# EAGLE design sound (EAGLE 9.4.2)

## Sheet 1 of 4: Bus interface
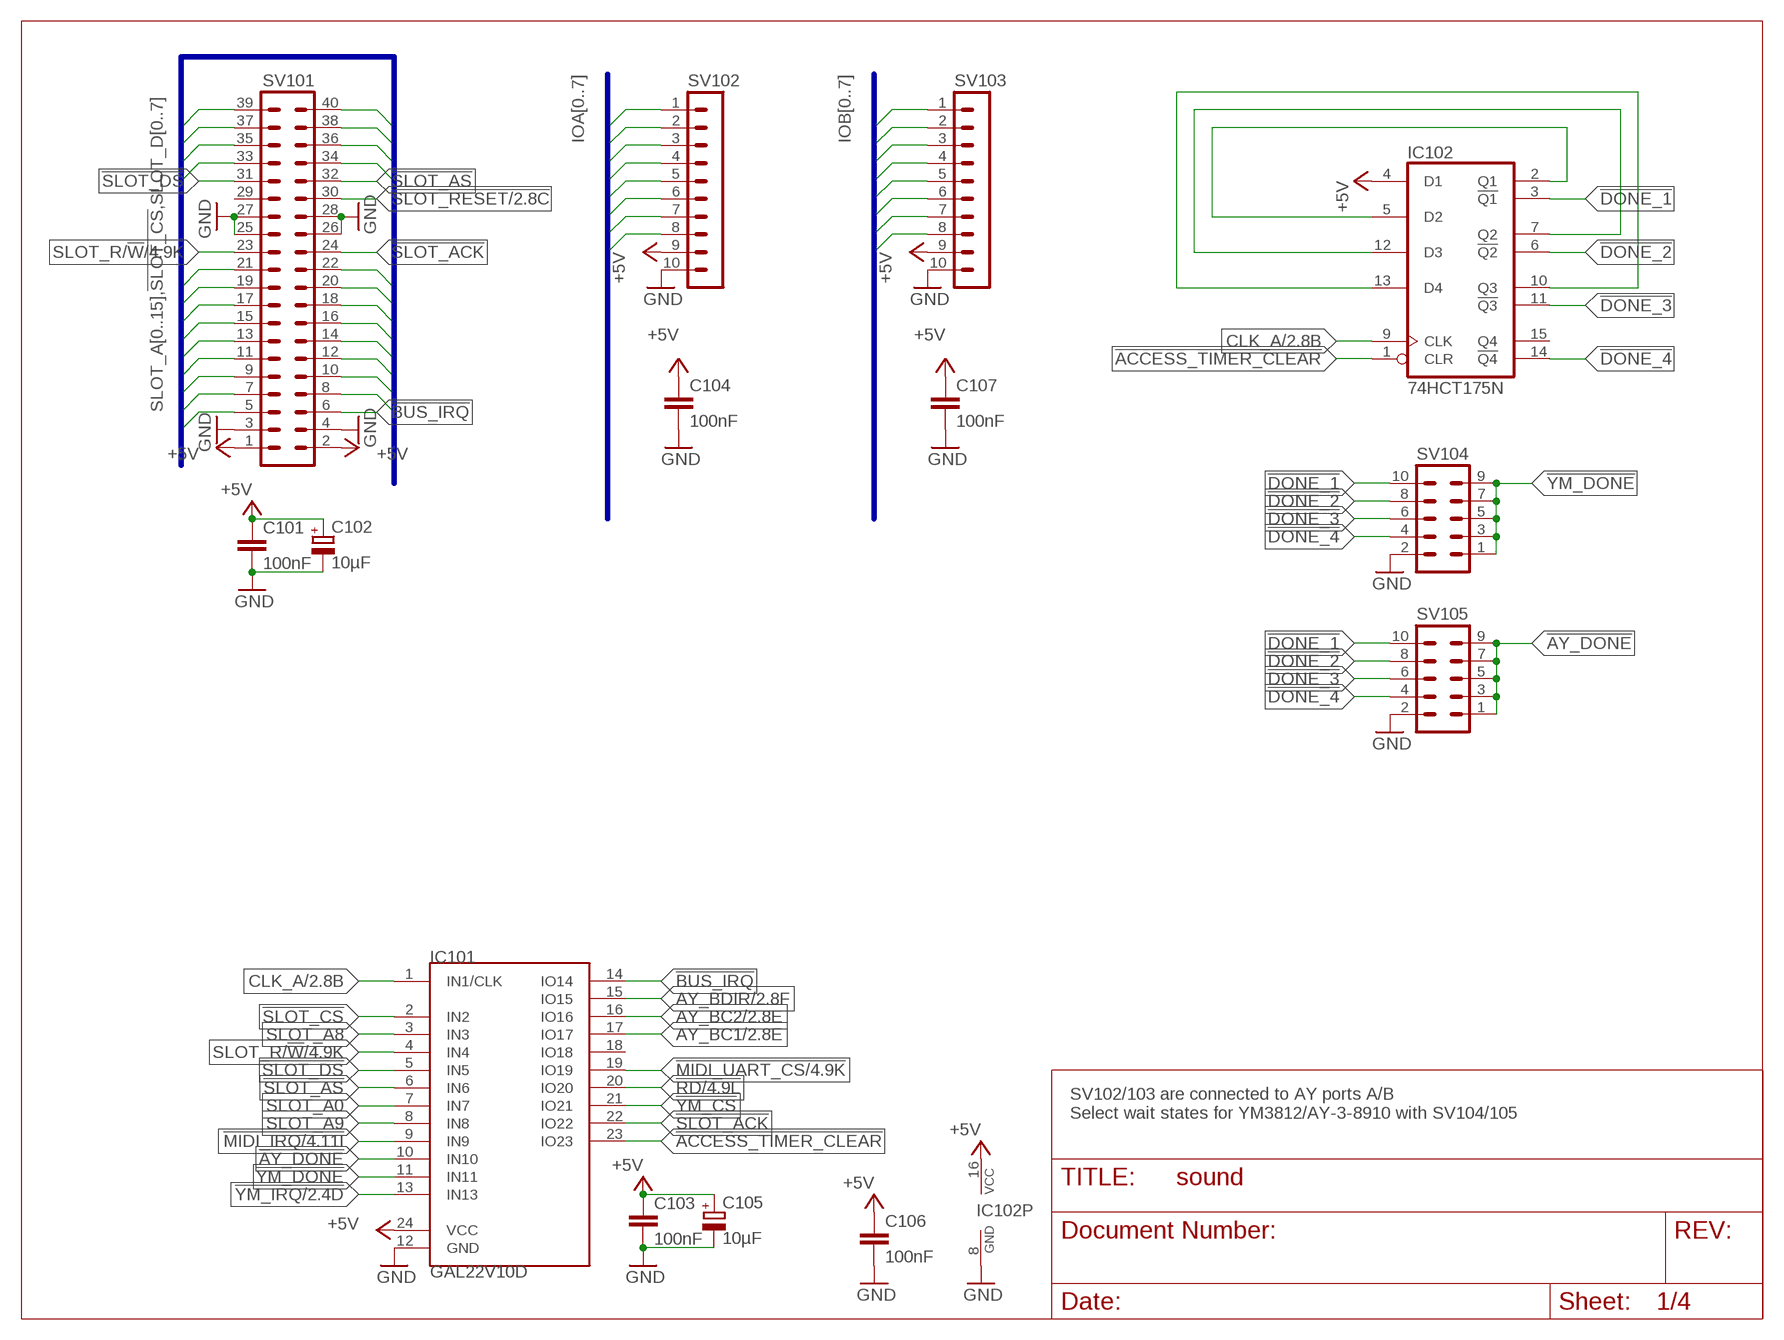
[diagram p0: schematic, sheet 1]

### Parts
C101  100nF  C-EUC0805  [C0805]
C102  10µF  CPOL-EUSMCB  [SMC_B]
C103  100nF  C-EUC0805  [C0805]
C104  100nF  C-EUC0805  [C0805]
C105  10µF  CPOL-EUSMCB  [SMC_B]
C106  100nF  C-EUC0805  [C0805]
C107  100nF  C-EUC0805  [C0805]
IC101  GAL22V10D  GAL22V10DIP24  [DIL24S]
IC102  74HCT175N  [DIL16]
SV101  MA20-2W  [MA20-2W]
SV102  MA10-1  [MA10-1]
SV103  MA10-1  [MA10-1]
SV104  MA05-2  [MA05-2]
SV105  MA05-2  [MA05-2]

### Nets
!ACCESS_TIMER_CLEAR: IC101.23(IO23) IC102.1(CLR)
!AY_DONE: IC101.10(IN10) SV105.1 SV105.3 SV105.5 SV105.7 SV105.9
!BUS_IRQ: IC101.14(IO14) SV101.6
!DONE_1: IC102.3(!Q1) SV104.10 SV105.10
!DONE_2: IC102.6(!Q2) SV104.8 SV105.8
!DONE_3: IC102.11(!Q3) SV104.6 SV105.6
!DONE_4: IC102.14(!Q4) SV104.4 SV105.4
!MIDI_IRQ: IC101.9(IN9) ; also sheet 4
!MIDI_UART_CS: IC101.19(IO19) ; also sheet 4
!RD: IC101.20(IO20) ; also sheet 2,4
!SLOT_ACK: IC101.22(IO22) SV101.24
!SLOT_AS: IC101.6(IN6) SV101.32
!SLOT_CS: IC101.2(IN2) SV101.5
!SLOT_DS: IC101.5(IN5) SV101.31
!SLOT_RESET: SV101.30 ; also sheet 2,4
!YM_CS: IC101.21(IO21) ; also sheet 2
!YM_DONE: IC101.11(IN11) SV104.1 SV104.3 SV104.5 SV104.7 SV104.9
!YM_IRQ: IC101.13(IN13) ; also sheet 2
+5V: C101.1 C102.+ C103.1 C104.1 C105.+ C106.1 C107.1 IC101.24(VCC) IC102.4(D1) IC102.16(VCC) SV101.1 SV101.2 SV102.9 SV103.9 ; also sheet 2,3,4
AY_BC1: IC101.17(IO17) ; also sheet 2
AY_BC2: IC101.16(IO16) ; also sheet 2
AY_BDIR: IC101.15(IO15) ; also sheet 2
CLK_A: IC101.1(IN1/CLK) IC102.9(CLK) ; also sheet 2
GND: C101.2 C102.- C103.2 C104.2 C105.- C106.2 C107.2 IC101.12(GND) IC102.8(GND) SV101.3 SV101.4 SV101.25 SV101.26 SV101.27 SV101.28 SV102.10 SV103.10 SV104.2 SV105.2 ; also sheet 2,3,4
IOA0: SV102.1 ; also sheet 2
IOA1: SV102.2 ; also sheet 2
IOA2: SV102.3 ; also sheet 2
IOA3: SV102.4 ; also sheet 2
IOA4: SV102.5 ; also sheet 2
IOA5: SV102.6 ; also sheet 2
IOA6: SV102.7 ; also sheet 2
IOA7: SV102.8 ; also sheet 2
IOB0: SV103.1 ; also sheet 2
IOB1: SV103.2 ; also sheet 2
IOB2: SV103.3 ; also sheet 2
IOB3: SV103.4 ; also sheet 2
IOB4: SV103.5 ; also sheet 2
IOB5: SV103.6 ; also sheet 2
IOB6: SV103.7 ; also sheet 2
IOB7: SV103.8 ; also sheet 2
N$2: IC102.10(Q3) IC102.13(D4)
N$5: IC102.2(Q1) IC102.5(D2)
N$6: IC102.7(Q2) IC102.12(D3)
SLOT_A0: IC101.7(IN7) SV101.12 ; also sheet 2,4
SLOT_A1: SV101.10 ; also sheet 4
SLOT_A2: SV101.8 ; also sheet 4
SLOT_A3: SV101.7
SLOT_A4: SV101.9
SLOT_A5: SV101.11
SLOT_A6: SV101.14
SLOT_A7: SV101.13
SLOT_A8: IC101.3(IN3) SV101.16
SLOT_A9: IC101.8(IN8) SV101.15
SLOT_A10: SV101.18
SLOT_A11: SV101.17
SLOT_A12: SV101.20
SLOT_A13: SV101.19
SLOT_A14: SV101.22
SLOT_A15: SV101.21
SLOT_D0: SV101.35 ; also sheet 2,4
SLOT_D1: SV101.37 ; also sheet 2,4
SLOT_D2: SV101.39 ; also sheet 2,4
SLOT_D3: SV101.40 ; also sheet 2,4
SLOT_D4: SV101.38 ; also sheet 2,4
SLOT_D5: SV101.36 ; also sheet 2,4
SLOT_D6: SV101.34 ; also sheet 2,4
SLOT_D7: SV101.33 ; also sheet 2,4
SLOT_R/!W!: IC101.4(IN4) SV101.23 ; also sheet 2,4
Unconnected: IC101.18(IO18) IC102.15(Q4) SV101.29

### Buses
SLOT_A[0..15],!SLOT_CS,SLOT_D[0..7]
IOA[0..7]
IOB[0..7]

### Notes on the sheet
- SV102/103 are connected to AY ports A/B
  Select wait states for YM3812/AY-3-8910 with SV104/105

## Sheet 2 of 4: Sound Generators
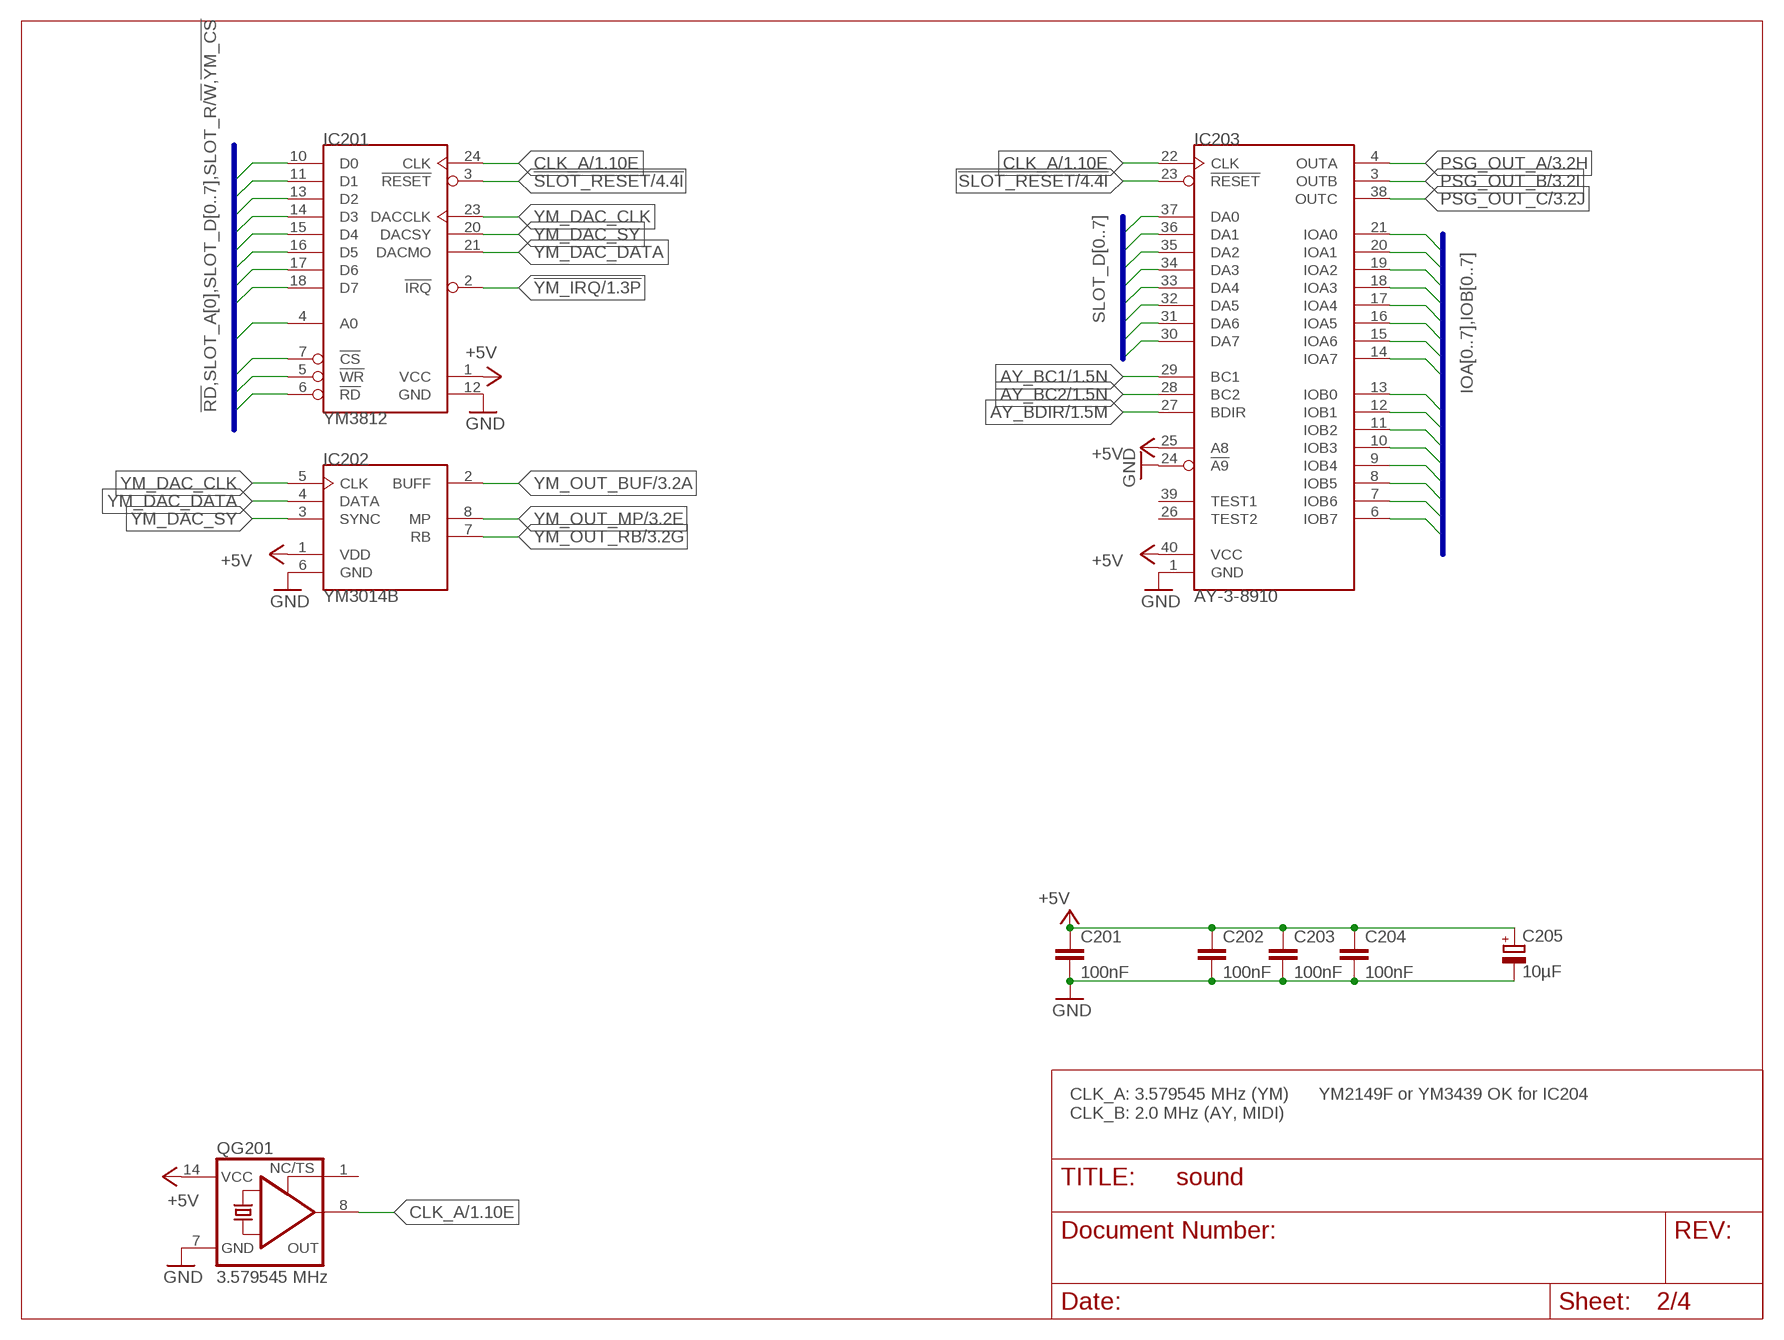
[diagram p1: schematic, sheet 2]

### Parts
C201  100nF  C-EUC0805  [C0805]
C202  100nF  C-EUC0805  [C0805]
C203  100nF  C-EUC0805  [C0805]
C204  100nF  C-EUC0805  [C0805]
C205  10µF  CPOL-EUSMCB  [SMC_B]
IC201  YM3812  YM3812DIL24  [DIL24]
IC202  YM3014B  YM3014BDIL8  [DIL8]
IC203  AY-3-8910  [DIL40]
QG201  3.579545 MHz  XO-14  [DIL14S]

### Nets
!RD: IC201.6(!RD) ; also sheet 1,4
!SLOT_RESET: IC201.3(!RESET) IC203.23(!RESET) ; also sheet 1,4
!YM_CS: IC201.7(!CS) ; also sheet 1
!YM_IRQ: IC201.2(!IRQ) ; also sheet 1
+5V: C201.1 C202.1 C203.1 C204.1 C205.+ IC201.1(VCC) IC202.1(VDD) IC203.25(A8) IC203.40(VCC) QG201.14(VCC) ; also sheet 1,3,4
AY_BC1: IC203.29(BC1) ; also sheet 1
AY_BC2: IC203.28(BC2) ; also sheet 1
AY_BDIR: IC203.27(BDIR) ; also sheet 1
CLK_A: IC201.24(CLK) IC203.22(CLK) QG201.8(OUT) ; also sheet 1
GND: C201.2 C202.2 C203.2 C204.2 C205.- IC201.12(GND) IC202.6(GND) IC203.1(GND) IC203.24(!A9) QG201.7(GND) ; also sheet 1,3,4
IOA0: IC203.21(IOA0) ; also sheet 1
IOA1: IC203.20(IOA1) ; also sheet 1
IOA2: IC203.19(IOA2) ; also sheet 1
IOA3: IC203.18(IOA3) ; also sheet 1
IOA4: IC203.17(IOA4) ; also sheet 1
IOA5: IC203.16(IOA5) ; also sheet 1
IOA6: IC203.15(IOA6) ; also sheet 1
IOA7: IC203.14(IOA7) ; also sheet 1
IOB0: IC203.13(IOB0) ; also sheet 1
IOB1: IC203.12(IOB1) ; also sheet 1
IOB2: IC203.11(IOB2) ; also sheet 1
IOB3: IC203.10(IOB3) ; also sheet 1
IOB4: IC203.9(IOB4) ; also sheet 1
IOB5: IC203.8(IOB5) ; also sheet 1
IOB6: IC203.7(IOB6) ; also sheet 1
IOB7: IC203.6(IOB7) ; also sheet 1
PSG_OUT_A: IC203.4(OUTA) ; also sheet 3
PSG_OUT_B: IC203.3(OUTB) ; also sheet 3
PSG_OUT_C: IC203.38(OUTC) ; also sheet 3
SLOT_A0: IC201.4(A0) ; also sheet 1,4
SLOT_D0: IC201.10(D0) IC203.37(DA0) ; also sheet 1,4
SLOT_D1: IC201.11(D1) IC203.36(DA1) ; also sheet 1,4
SLOT_D2: IC201.13(D2) IC203.35(DA2) ; also sheet 1,4
SLOT_D3: IC201.14(D3) IC203.34(DA3) ; also sheet 1,4
SLOT_D4: IC201.15(D4) IC203.33(DA4) ; also sheet 1,4
SLOT_D5: IC201.16(D5) IC203.32(DA5) ; also sheet 1,4
SLOT_D6: IC201.17(D6) IC203.31(DA6) ; also sheet 1,4
SLOT_D7: IC201.18(D7) IC203.30(DA7) ; also sheet 1,4
SLOT_R/!W!: IC201.5(!WR) ; also sheet 1,4
YM_DAC_CLK: IC201.23(DACCLK) IC202.5(CLK)
YM_DAC_DATA: IC201.21(DACMO) IC202.4(DATA)
YM_DAC_SY: IC201.20(DACSY) IC202.3(SYNC)
YM_OUT_BUF: IC202.2(BUFF) ; also sheet 3
YM_OUT_MP: IC202.8(MP) ; also sheet 3
YM_OUT_RB: IC202.7(RB) ; also sheet 3
Unconnected: IC203.26(TEST2) IC203.39(TEST1) QG201.1(TS)

### Buses
IOA[0..7],IOB[0..7]
!RD,SLOT_A[0],SLOT_D[0..7],SLOT_R/!W!,!YM_CS
SLOT_D[0..7]

### Notes on the sheet
- CLK_A: 3.579545 MHz (YM)
  CLK_B: 2.0 MHz (AY, MIDI)
- YM2149F or YM3439 OK for IC204

## Sheet 3 of 4: Analog
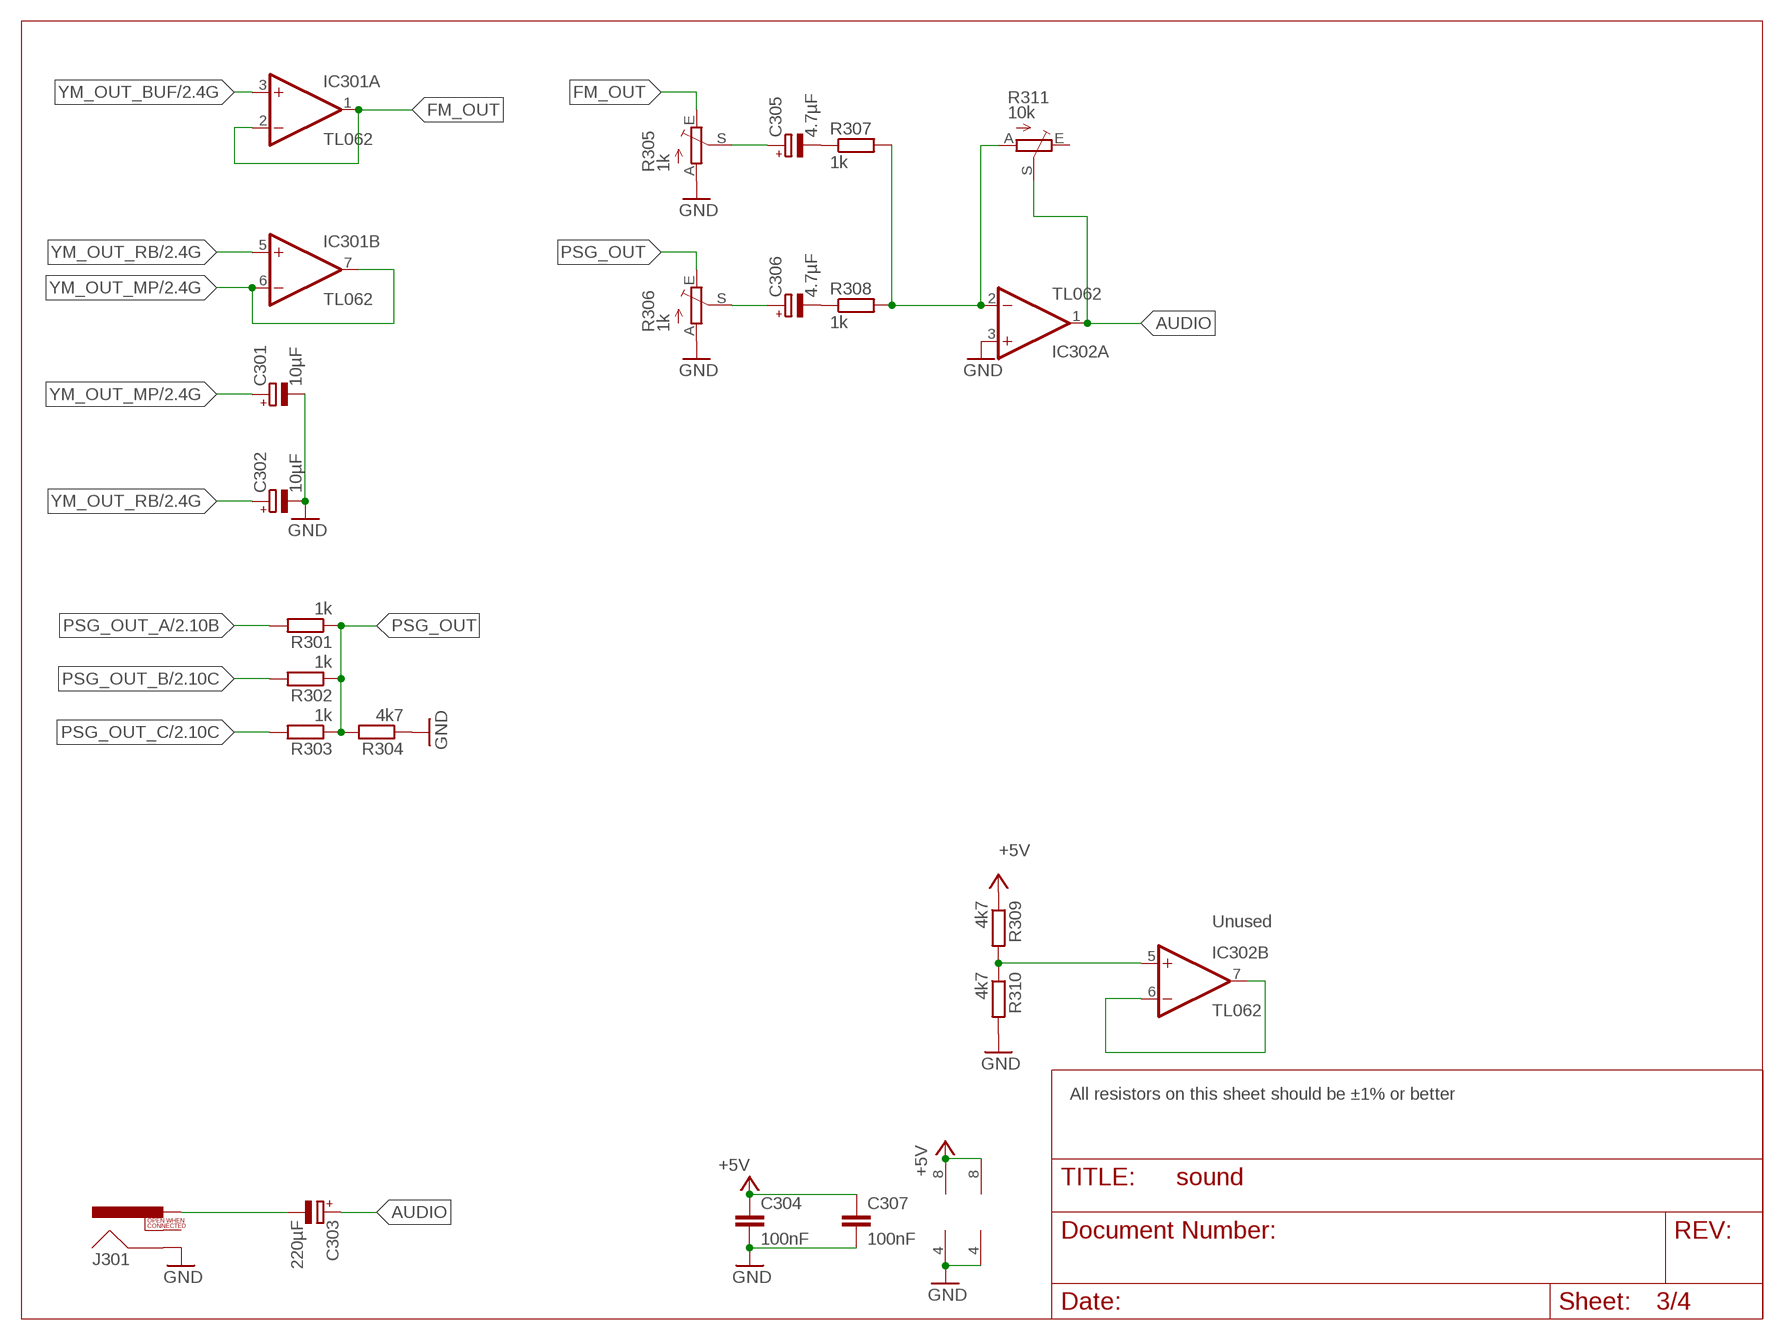
[diagram p2: schematic, sheet 3]

### Parts
C301  10µF  CPOL-EUE2-5  [E2-5]
C302  10µF  CPOL-EUE2-5  [E2-5]
C303  220µF  CPOL-EUE2.5-6  [E2,5-6]
C304  100nF  C-EUC0805  [C0805]
C305  4.7µF  CPOL-EUE2-5  [E2-5]
C306  4.7µF  CPOL-EUE2-5  [E2-5]
C307  100nF  C-EUC0805  [C0805]
IC301  TL062  TL062P  [DIL08]
IC302  TL062  TL062P  [DIL08]
J301  RCALOCK  [RCA_LOCK]
R301  1k  R-EU_R2012  [R2012]
R302  1k  R-EU_R2012  [R2012]
R303  1k  R-EU_R2012  [R2012]
R304  4k7  R-EU_R2012  [R2012]
R305  1k  TRIM_EU-PT10S  [PT-10S]
R306  1k  TRIM_EU-PT10S  [PT-10S]
R307  1k  R-EU_R2012  [R2012]
R308  1k  R-EU_R2012  [R2012]
R309  4k7  R-EU_R2012  [R2012]
R310  4k7  R-EU_R2012  [R2012]
R311  10k  TRIM_EU-PT10S  [PT-10S]

### Nets
+5V: C304.1 C307.1 IC301.8(P:V+) IC302.8(P:V+) R309.1 ; also sheet 1,2,4
AUDIO: C303.+ IC302.1(A:OUT) R311.S
FM_OUT: IC301.1(A:OUT) IC301.2(A:-IN) R305.E
GND: C301.- C302.- C304.2 C307.2 IC301.4(P:V-) IC302.3(A:+IN) IC302.4(P:V-) J301.SHELL R304.1 R305.A R306.A R310.2 ; also sheet 1,2,4
N$1: C305.+ R305.S
N$4: C303.- J301.PIN
N$7: C306.+ R306.S
N$10: C305.- R307.1
N$11: C306.- R308.1
N$12: IC302.2(A:-IN) R307.2 R308.2 R311.A
N$13: IC302.6(B:-IN) IC302.7(B:OUT)
N$15: IC302.5(B:+IN) R309.2 R310.1
PSG_OUT: R301.1 R302.1 R303.1 R304.2 R306.E
PSG_OUT_A: R301.2 ; also sheet 2
PSG_OUT_B: R302.2 ; also sheet 2
PSG_OUT_C: R303.2 ; also sheet 2
YM_OUT_BUF: IC301.3(A:+IN) ; also sheet 2
YM_OUT_MP: C301.+ IC301.6(B:-IN) IC301.7(B:OUT) ; also sheet 2
YM_OUT_RB: C302.+ IC301.5(B:+IN) ; also sheet 2
Unconnected: J301.SWITCH R311.E

### Notes on the sheet
- Unused
- All resistors on this sheet should be ±1% or better

## Sheet 4 of 4: MIDI Interface
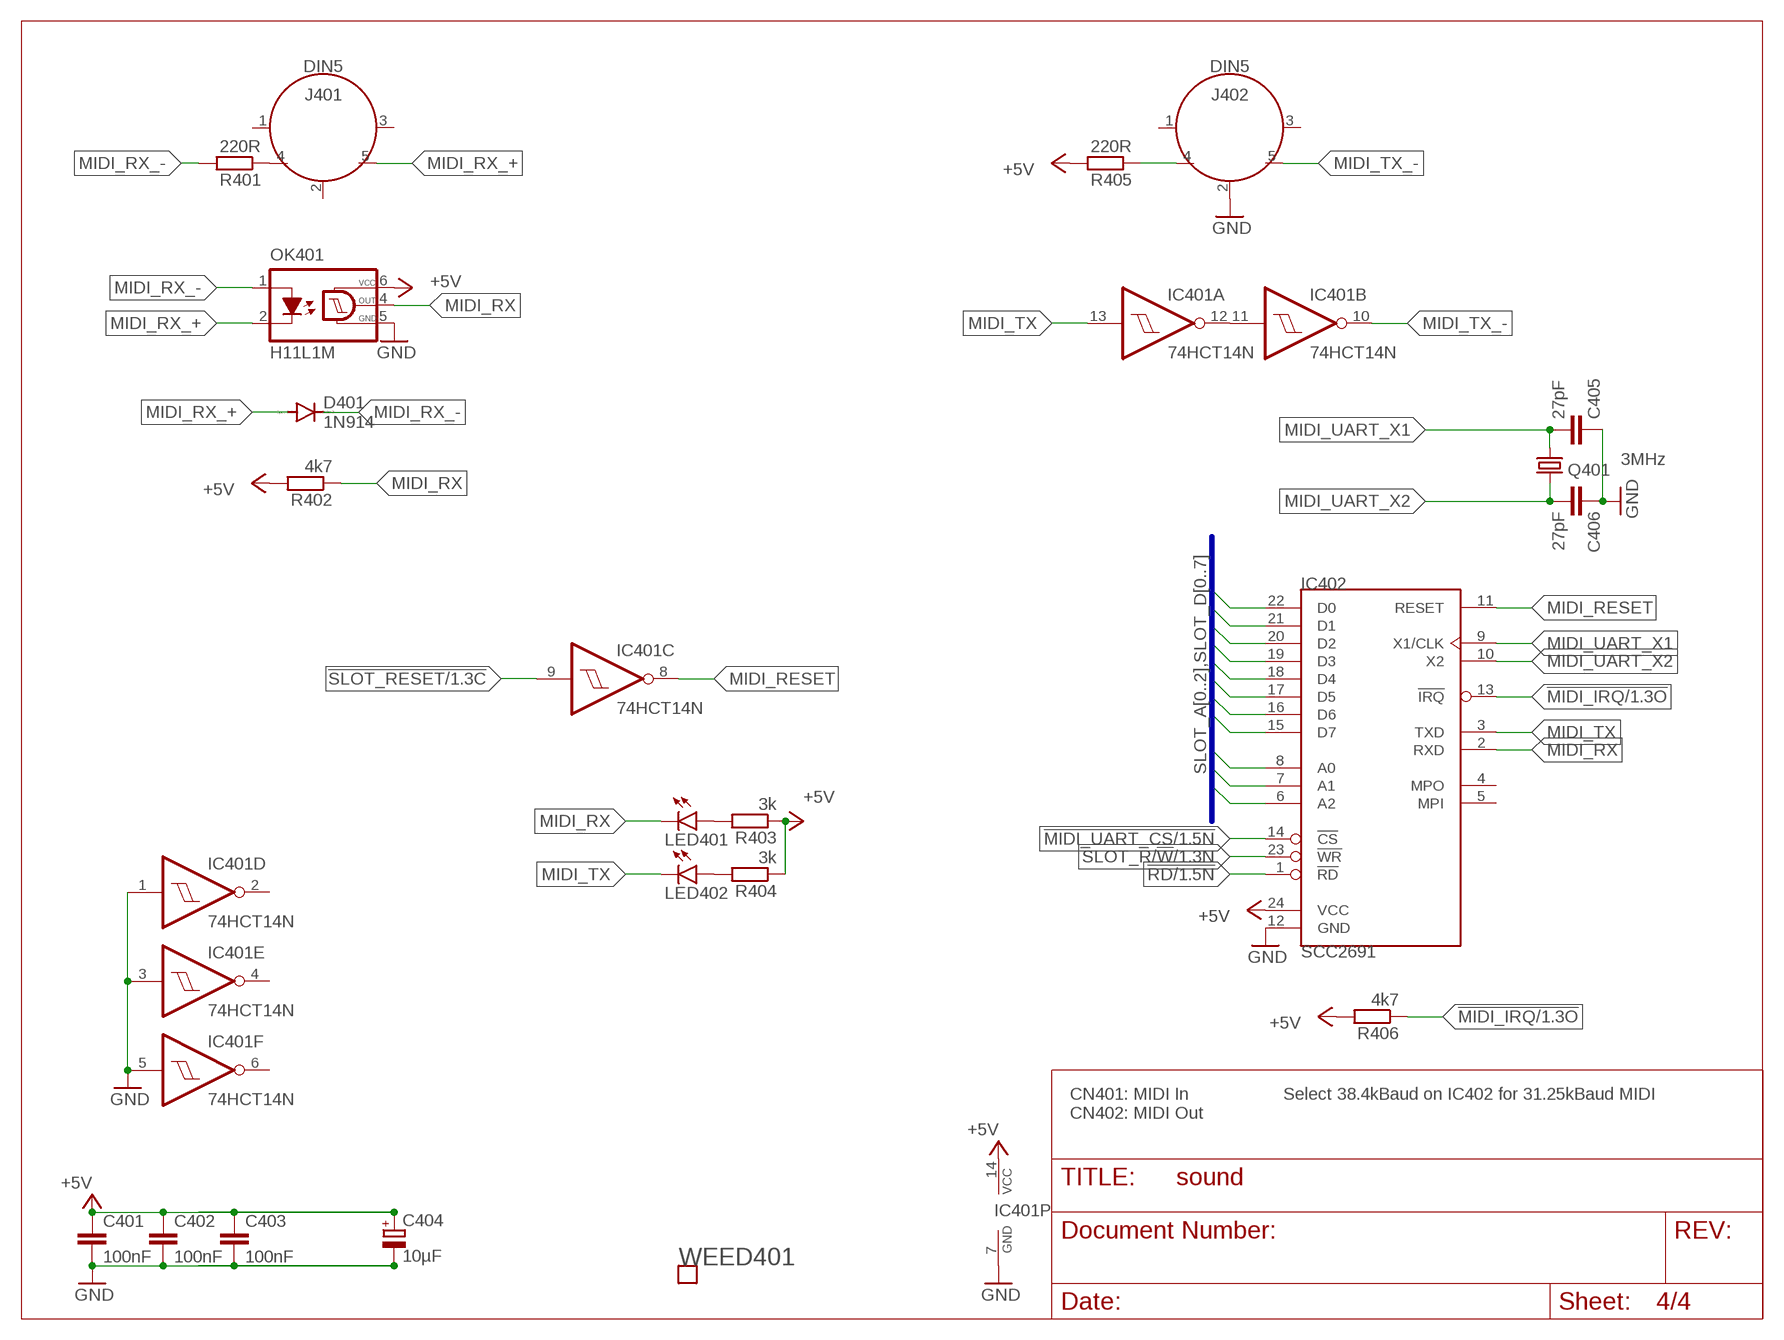
[diagram p3: schematic, sheet 4]

### Parts
C401  100nF  C-EUC0805  [C0805]
C402  100nF  C-EUC0805  [C0805]
C403  100nF  C-EUC0805  [C0805]
C404  10µF  CPOL-EUSMCB  [SMC_B]
C405  27pF  C-EUC0805  [C0805]
C406  27pF  C-EUC0805  [C0805]
D401  1N914  1N4148DO35-10  [DO35-10]
IC401  74HCT14N  [DIL14]
IC402  SCC2691  [DIL24S]
J401  DIN5  [DIN5-RA-PTH]
J402  DIN5  [DIN5-RA-PTH]
LED401  LEDCHIPLED_1206  [CHIPLED_1206]
LED402  LEDCHIPLED_1206  [CHIPLED_1206]
OK401  H11L1M  [DIL06]
Q401  3MHz  CRYSTALHC49S  [HC49/S]
R401  220R  R-EU_R2012  [R2012]
R402  4k7  R-EU_R2012  [R2012]
R403  3k  R-EU_R2012  [R2012]
R404  3k  R-EU_R2012  [R2012]
R405  220R  R-EU_R2012  [R2012]
R406  4k7  R-EU_R2012  [R2012]
WEED401  WEED  [DOINK]

### Nets
!MIDI_IRQ: IC402.13(!IRQ) R406.1 ; also sheet 1
!MIDI_UART_CS: IC402.14(!CS) ; also sheet 1
!RD: IC402.1(!RD) ; also sheet 1,2
!SLOT_RESET: IC401.9(C:I) ; also sheet 1,2
+5V: C401.1 C402.1 C403.1 C404.+ IC401.14(P:VCC) IC402.24(VCC) OK401.6(VCC) R402.2 R403.1 R404.1 R405.2 R406.2 ; also sheet 1,2,3
GND: C401.2 C402.2 C403.2 C404.- C405.1 C406.1 IC401.1(D:I) IC401.3(E:I) IC401.5(F:I) IC401.7(P:GND) IC402.12(GND) J402.2 OK401.5(GND) ; also sheet 1,2,3
MIDI_RESET: IC401.8(C:O) IC402.11(RESET)
MIDI_RX: IC402.2(RXD) LED401.C OK401.4(OUT) R402.1
MIDI_RX_+: D401.A J401.5 OK401.2(C)
MIDI_RX_-: D401.C OK401.1(A) R401.2
MIDI_TX: IC401.13(A:I) IC402.3(TXD) LED402.C
MIDI_TX_-: IC401.10(B:O) J402.5
MIDI_UART_X1: C405.2 IC402.9(X1/CLK) Q401.1
MIDI_UART_X2: C406.2 IC402.10(X2) Q401.2
N$3: LED401.A R403.2
N$8: LED402.A R404.2
N$14: J401.4 R401.1
N$16: IC401.11(B:I) IC401.12(A:O)
N$17: J402.4 R405.1
SLOT_A0: IC402.8(A0) ; also sheet 1,2
SLOT_A1: IC402.7(A1) ; also sheet 1
SLOT_A2: IC402.6(A2) ; also sheet 1
SLOT_D0: IC402.22(D0) ; also sheet 1,2
SLOT_D1: IC402.21(D1) ; also sheet 1,2
SLOT_D2: IC402.20(D2) ; also sheet 1,2
SLOT_D3: IC402.19(D3) ; also sheet 1,2
SLOT_D4: IC402.18(D4) ; also sheet 1,2
SLOT_D5: IC402.17(D5) ; also sheet 1,2
SLOT_D6: IC402.16(D6) ; also sheet 1,2
SLOT_D7: IC402.15(D7) ; also sheet 1,2
SLOT_R/!W!: IC402.23(!WR) ; also sheet 1,2
Unconnected: IC401.2(D:O) IC401.4(E:O) IC401.6(F:O) IC402.4(MPO) IC402.5(MPI) J401.1 J401.2 J401.3 J402.1 J402.3

### Buses
SLOT_A[0..2],SLOT_D[0..7]

### Notes on the sheet
- CN401: MIDI In
  CN402: MIDI Out
- Select 38.4kBaud on IC402 for 31.25kBaud MIDI

## Library data of the parts
C101 C103 C104 C106 C107 C201-C204 C304 C307 C401-C403 = rcl:C-EU: CAPACITOR, European symbol; MOUSER: 710-885012207072; SPICEPREFIX: C
C102 C105 C205 C404 = rcl:CPOL-EU: POLARIZED CAPACITOR, European symbol; MOUSER: 581-TAJB106K020RNJV; SPICEPREFIX: C
C301 C302 = rcl:CPOL-EU: POLARIZED CAPACITOR, European symbol; MOUSER: 710-860020472003; SPICEPREFIX: C
C303 = rcl:CPOL-EU: POLARIZED CAPACITOR, European symbol; MOUSER: 710-860020373010; SPICEPREFIX: C
C305 C306 = rcl:CPOL-EU: POLARIZED CAPACITOR, European symbol; MOUSER: 710-860020472001; SPICEPREFIX: C
C405 C406 = rcl:C-EU: CAPACITOR, European symbol; MOUSER: 80-C0805C270K5HACTU; SPICEPREFIX: C
D401 = diode:1N4148: DIODE high speed (Philips); MOUSER: 512-1N914TR
IC101 = 68komputer:GAL22V10: GAL22V10D – Generic Array Logic Datasheet <http://web.mit.edu/6.115/www/document/gal22v10.pdf>; MOUSER_SOCKET: 575-11044324
IC102 = 74xx-eu:74*175: Qadruple D type FLIP FLOP, clear; MOUSER: 595-CD74HCT175E; MOUSER_SOCKET: 575-1104731641001000
IC201 = 68komputer:YM3812: YM3812 – FM Operator Type-L Ⅱ (OPL2) Datasheet <http://www.symphoniae.com/Yamaha/YSC/YM3812.pdf>; MOUSER_SOCKET: 575-1104762441001000
IC202 = 68komputer:YM3014B: YM3014 – Floating D/A Converter (for YM3812) Datasheet <http://www.atkinsoft.com/datasheets/YM3014B.PDF>; MOUSER_SOCKET: 575-1104730841001000
IC203 = 68komputer:AY-3-8910: AY-3-8910 – Programmable Sound Generator Datasheet <http://www.ym2149.com/ay8910.pdf>; MOUSER_SOCKET: 575-11044640
IC301 IC302 = linear:TL062: OP AMP; MOUSER: 595-TL062CP; MOUSER_SOCKET: 575-1104730841001000; SPICEPREFIX: J
IC401 = 74xx-eu:74*14: Hex schmitt trigger INVERTER; MOUSER: 595-SN74HCT14N; MOUSER_SOCKET: 575-1104731441001000
IC402 = 68komputer:SCC2691: SCC2691 – Universal asynchronous receiver/transmitter (UART) Datasheet <https://www.nxp.com/docs/en/data-sheet/SCC2691.pdf>; MOUSER_SOCKET: 575-11044324
J301 = SparkFun-Connectors:RCA: RCA Jack connector This is a right angle RCA jack connecotr. Commonly used for video or audio. Here is the connector we sell at SparkFun: RCA Jack <https://www.sparkfun.com/products/8631> (PRT-08631) Datasheet <http://www.sparkfun.com/datasheets/Prototyping/Connectors/RCA-Jack.pdf> It is not used on any active designs, however it was used on a couple retired products: RCA Jack Breakout [RETIRED] <https://www.sparkfun.com/products/8826> (PRT-08826) SparkFun On Screen Display Breakout - MAX7456 [RETIRED] <https://www.sparkfun.com/products/9168> (BOB-09168) You may also be interested in a cable: RCA Video Cable - 6' <https://www.sparkfun.com/products/11573> (CAB-11573); MOUSER: 502-PJRAN1X1U03AUX
J401 J402 = SparkFun-Connectors:DIN5: DIN5 Connector - Female Right Angle (frequently used as a MIDI Jack connector) This type of connector and cable is frequently used for transmitting midi data (musical instrument digital interface). It is what you usually see on a keyboard or set of electronic drums. Learn more here <https://en.wikipedia.org/wiki/MIDI>. For more information on the pinout and electrical specifications of MIDI communications, please see the following resource: https://www.midi.org/specifications/item/midi-din-electrical-specification Here is the connector we sell at SparkFun: MIDI Connector - Female Right Angle <https://www.sparkfun.com/products/9536> (PRT-09536) Datasheet <hhttp://www.sparkfun.com/datasheets/Prototyping/Connectors/MIDI-RA.pdf> It is used on this SparkFun product: SparkFun MIDI Shield <https://www.sparkfun.com/products/12898> (DEV-12898); PROD_ID: CONN-09481
LED401 LED402 = led:LED: LED OSRAM: - CHIPLED LG R971, LG N971, LY N971, LG Q971, LY Q971, LO R971, LY R971 LH N974, LH R974 LS Q976, LO Q976, LY Q976 LO Q996 - Hyper CHIPLED LW Q18S LB Q993, LB Q99A, LB R99A - SideLED LS A670, LO A670, LY A670, LG A670, LP A670 LB A673, LV A673, LT A673, LW A673 LH A674 LY A675 LS A676, LA A676, LO A676, LY A676, LW A676 LS A679, LY A679, LG A679 - Hyper Micro SIDELED® LS Y876, LA Y876, LO Y876, LY Y876 LT Y87S - SmartLED LW L88C, LW L88S LB L89C, LB L89S, LG L890 LS L89K, LO L89K, LY L89K LS L896, LA L896, LO L896, LY L896 - TOPLED LS T670, LO T670, LY T670, LG T670, LP T670 LSG T670, LSP T670, LSY T670, LOP T670, LYG T670 LG T671, LOG T671, LSG T671 LB T673, LV T673, LT T673, LW T673 LH T674 LS T676, LA T676, LO T676, LY T676, LB T676, LH T676, LSB T676, LW T676 LB T67C, LV T67C, LT T67C, LS T67K, LO T67K, LY T67K, LW E67C LS E67B, LA E67B, LO E67B, LY E67B, LB E67C, LV E67C, LT E67C LW T67C LS T679, LY T679, LG T679 LS T770, LO T770, LY T770, LG T770, LP T770 LB T773, LV T773, LT T773, LW T773 LH T774 LS E675, LA E675, LY E675, LS T675 LS T776, LA T776, LO T776, LY T776, LB T776 LHGB T686 LT T68C, LB T68C - Hyper Mini TOPLED® LB M676 - Mini TOPLED Santana® LG M470 LS M47K, LO M47K, LY M47K Source: http://www.osram.convergy.de LUXEON: - LUMILED® LXK2-PW12-R00, LXK2-PW12-S00, LXK2-PW14-U00, LXK2-PW14-V00 LXK2-PM12-R00, LXK2-PM12-S00, LXK2-PM14-U00 LXK2-PE12-Q00, LXK2-PE12-R00, LXK2-PE12-S00, LXK2-PE14-T00, LXK2-PE14-U00 LXK2-PB12-K00, LXK2-PB12-L00, LXK2-PB12-M00, LXK2-PB14-N00, LXK2-PB14-P00, LXK2-PB14-Q00 LXK2-PR12-L00, LXK2-PR12-M00, LXK2-PR14-Q00, LXK2-PR14-R00 LXK2-PD12-Q00, LXK2-PD12-R00, LXK2-PD12-S00 LXK2-PH12-R00, LXK2-PH12-S00 LXK2-PL12-P00, LXK2-PL12-Q00, LXK2-PL12-R00 Source: www.luxeon.com KINGBRIGHT: KA-3528ASYC Source: www.kingbright.com; MOUSER: 710-156120VS75300
OK401 = optocoupler:H11L*M: 6-Pin DIP Optocoupler Source: http://www.fairchildsemi.com/ds/H1/H11L2-M.pdf; MF: FAIRCHILD SEMICONDUCTOR; MOUSER: 512-H11L1M; MOUSER_SOCKET: 575-1104730641001000; MPN: H11L1-M; OC_FARNELL: 1021127; OC_NEWARK: 72K8643
Q401 = crystal:CRYSTAL: CRYSTAL; MOUSER: 520-HCA300-SX; OC_FARNELL: 1667008; OC_NEWARK: unknown
QG201 = crystal:XO-: CRYSTAL; MOUSER: 520-TCF357-X; MOUSER_SOCKET: 535-1107741; OC_FARNELL: unknown; OC_NEWARK: unknown
R301-R303 R307 R308 = rcl:R-EU_: RESISTOR, European symbol; MOUSER: 652-CR0805FX-1001ELF; SPICEPREFIX: R
R304 R309 R310 R402 R406 = rcl:R-EU_: RESISTOR, European symbol; MOUSER: 652-CR0805FX-4701ELF; SPICEPREFIX: R
R305 R306 = pot:TRIM_EU-: POTENTIOMETER; MOUSER: PT10LH01-102A2020-S; SPICEPREFIX: J
R311 = pot:TRIM_EU-: POTENTIOMETER; MOUSER: 531-PT10H-10K-S; SPICEPREFIX: J
R401 R405 = rcl:R-EU_: RESISTOR, European symbol; MOUSER: 652-CR0805FX-2200ELF; SPICEPREFIX: R
R403 R404 = rcl:R-EU_: RESISTOR, European symbol; MOUSER: 652-CR0805JW-302ELF; SPICEPREFIX: R
SV101 = con-lstb:MA20-2W: PIN HEADER; OC_FARNELL: unknown; OC_NEWARK: unknown
SV102 SV103 = con-lstb:MA10-1: PIN HEADER; OC_FARNELL: unknown; OC_NEWARK: unknown
SV104 SV105 = con-lstb:MA05-2: PIN HEADER; OC_FARNELL: unknown; OC_NEWARK: unknown
WEED401 = 68komputer:WEED

## Net classes
0 default: width 0.203 mm

## Board
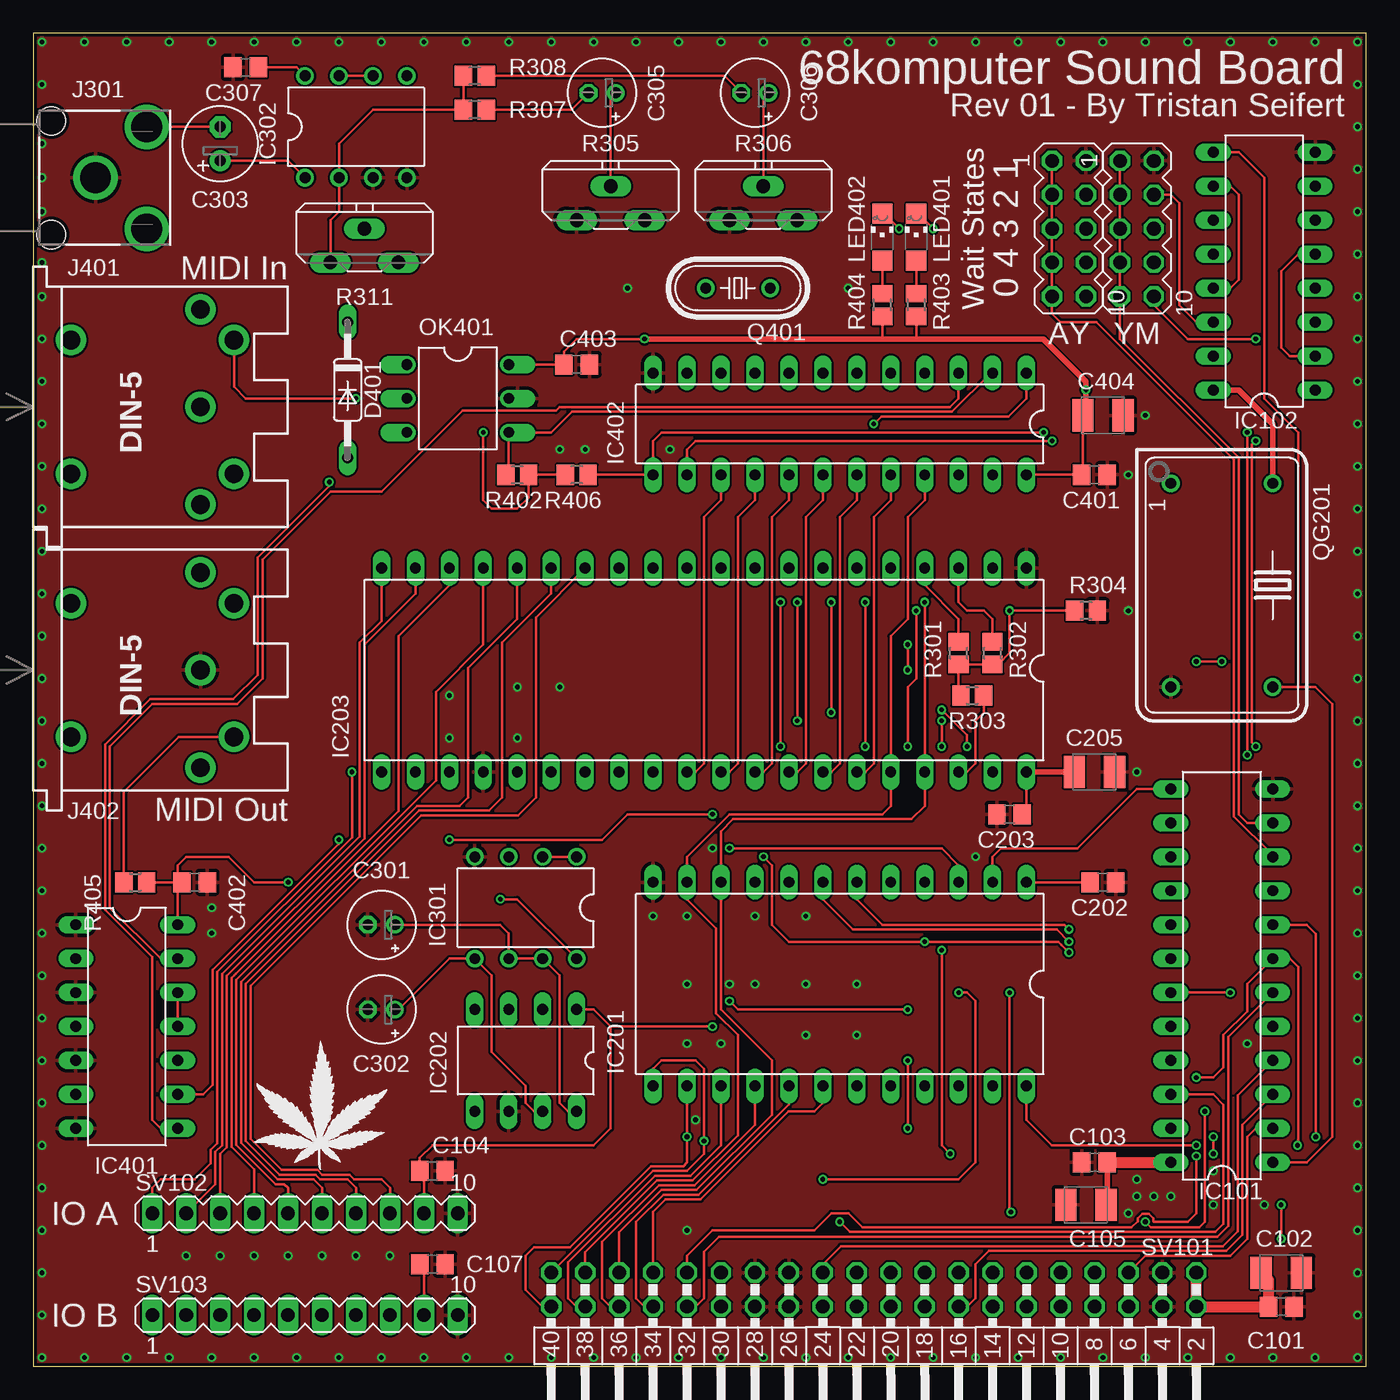
[diagram p4: board, top side]
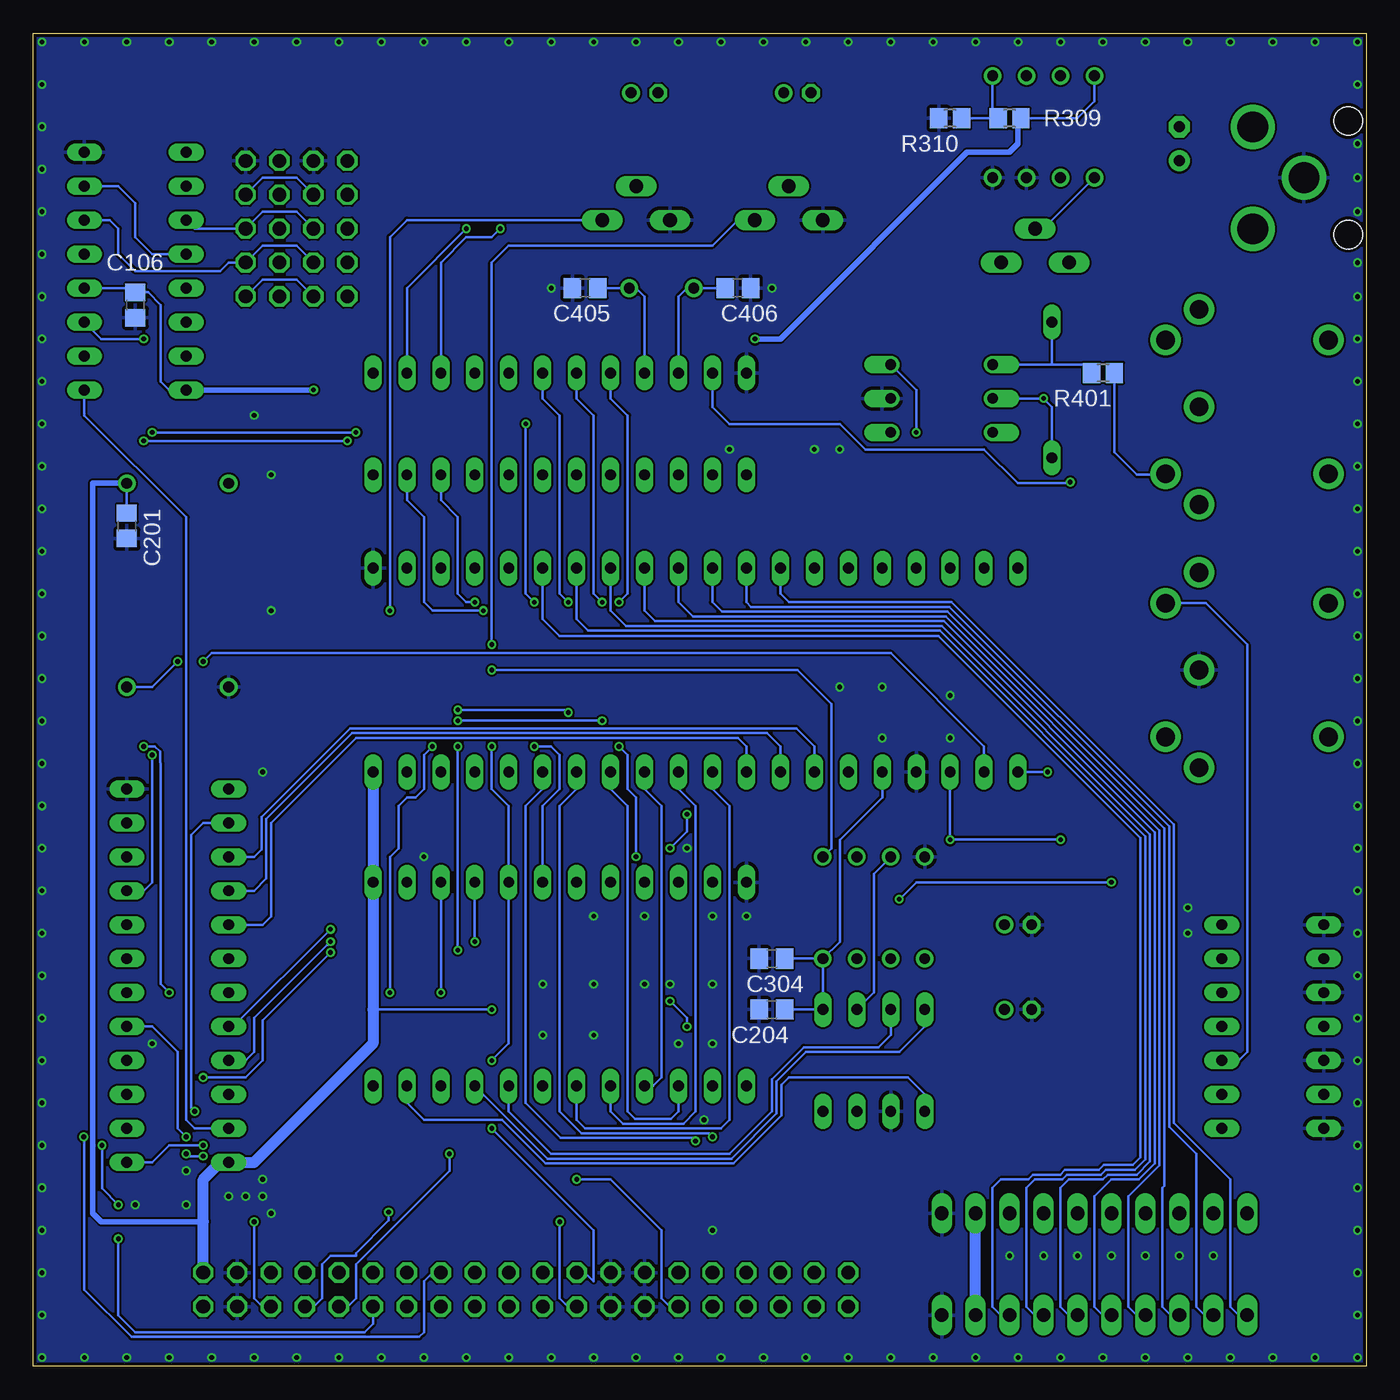
[diagram p5: board, bottom side, seen from below]

Size 99.69 x 99.69 mm. Coordinates in mm from the lower left corner, seen from the top.
Outline: 0,0 99.69,0 99.69,99.69 0,99.69 0,0
Copper layers (1*16): Top 0.035mm / dielectric 1.5mm / Bottom 0.035mm
Design rules "dirt_cheap_dirty_boards.v1.1": minimum track width 6mil, minimum drill 12mil, track to track 6mil, track to pad 6mil, pad to pad 6mil, via to via 6mil, smd to smd 0mil, copper to edge 10mil, drill to drill 10mil, minimum pad ring 10mil, minimum via ring 6mil, stop-mask expansion 2mil, vias tented up to drill 25mil, thermal gap 10mil

### Footprints (pad centres in the part's own frame; a part is rotated, then mirrored left to right if it is on the bottom)
C0805 = smd 1.3 x 1.5: 1 -0.95,0; 2 0.95,0
SMC_B = smd 1.6 x 2.4: + -1.5,0; - 1.5,0
E2-5 = drill 0.813 pad 1.27: + -1.016,0 | drill 0.813 pad 1.27 octagon: - 1.016,0
E2,5-6 = drill 0.813 pad 1.6: + -1.27,0 | drill 0.813 pad 1.6 octagon: - 1.27,0
DO35-10 = drill 0.813 long: A 5.08,0; C -5.08,0
DIL24S = drill 0.813 long: 1 -13.97,-3.81; 2 -11.43,-3.81; 3 -8.89,-3.81; 4 -6.35,-3.81; 5 -3.81,-3.81; 6 -1.27,-3.81; 7 1.27,-3.81; 8 3.81,-3.81; 9 6.35,-3.81; 10 8.89,-3.81; 11 11.43,-3.81; 12 13.97,-3.81; 13 13.97,3.81; 14 11.43,3.81; 15 8.89,3.81; 16 6.35,3.81; 17 3.81,3.81; 18 1.27,3.81; 19 -1.27,3.81; 20 -3.81,3.81; 21 -6.35,3.81; 22 -8.89,3.81; 23 -11.43,3.81; 24 -13.97,3.81
DIL16 = drill 0.813 long: 1 -8.89,-3.81; 2 -6.35,-3.81; 3 -3.81,-3.81; 4 -1.27,-3.81; 5 1.27,-3.81; 6 3.81,-3.81; 7 6.35,-3.81; 8 8.89,-3.81; 9 8.89,3.81; 10 6.35,3.81; 11 3.81,3.81; 12 1.27,3.81; 13 -1.27,3.81; 14 -3.81,3.81; 15 -6.35,3.81; 16 -8.89,3.81
DIL24 = drill 0.813 long: 1 -13.97,-7.62; 2 -11.43,-7.62; 3 -8.89,-7.62; 4 -6.35,-7.62; 5 -3.81,-7.62; 6 -1.27,-7.62; 7 1.27,-7.62; 8 3.81,-7.62; 9 6.35,-7.62; 10 8.89,-7.62; 11 11.43,-7.62; 12 13.97,-7.62; 13 13.97,7.62; 14 11.43,7.62; 15 8.89,7.62; 16 6.35,7.62; 17 3.81,7.62; 18 1.27,7.62; 19 -1.27,7.62; 20 -3.81,7.62; 21 -6.35,7.62; 22 -8.89,7.62; 23 -11.43,7.62; 24 -13.97,7.62
DIL8 = drill 0.813 long: 1 -3.81,-3.81; 2 -1.27,-3.81; 3 1.27,-3.81; 4 3.81,-3.81; 5 3.81,3.81; 6 1.27,3.81; 7 -1.27,3.81; 8 -3.81,3.81
DIL40 = drill 0.813 long: 1 -24.13,-7.62; 2 -21.59,-7.62; 3 -19.05,-7.62; 4 -16.51,-7.62; 5 -13.97,-7.62; 6 -11.43,-7.62; 7 -8.89,-7.62; 8 -6.35,-7.62; 9 -3.81,-7.62; 10 -1.27,-7.62; 11 1.27,-7.62; 12 3.81,-7.62; 13 6.35,-7.62; 14 8.89,-7.62; 15 11.43,-7.62; 16 13.97,-7.62; 17 16.51,-7.62; 18 19.05,-7.62; 19 21.59,-7.62; 20 24.13,-7.62; 21 24.13,7.62; 22 21.59,7.62; 23 19.05,7.62; 24 16.51,7.62; 25 13.97,7.62; 26 11.43,7.62; 27 8.89,7.62; 28 6.35,7.62; 29 3.81,7.62; 30 1.27,7.62; 31 -1.27,7.62; 32 -3.81,7.62; 33 -6.35,7.62; 34 -8.89,7.62; 35 -11.43,7.62; 36 -13.97,7.62; 37 -16.51,7.62; 38 -19.05,7.62; 39 -21.59,7.62; 40 -24.13,7.62
DIL08 = drill 0.813 pad 1.27: 1 -3.81,-3.81; 2 -1.27,-3.81; 3 1.27,-3.81; 4 3.81,-3.81; 5 3.81,3.81; 6 1.27,3.81; 7 -1.27,3.81; 8 -3.81,3.81
DIL14 = drill 0.813 long: 1 -7.62,-3.81; 2 -5.08,-3.81; 3 -2.54,-3.81; 4 0,-3.81; 5 2.54,-3.81; 6 5.08,-3.81; 7 7.62,-3.81; 8 7.62,3.81; 9 5.08,3.81; 10 2.54,3.81; 11 0,3.81; 12 -2.54,3.81; 13 -5.08,3.81; 14 -7.62,3.81
RCA_LOCK = drill 2.3: PIN 4.03,3.802; SHELL 0.203,0; SWITCH 4.03,-3.827 | hole 2.134: -3.1,4.25; -3.1,-4.25
DIN5-RA-PTH = drill 1.4 pad 2.286: 1 7.3,12.5; 2 0,12.5; 3 -7.3,12.5; 4 5,15; 5 -5,15; 6 -5,2.8; 7 5,2.8
CHIPLED_1206 = smd 1.5 x 1.5: A 0,-1.75; C 0,1.75
DIL06 = drill 0.813 offset: 1 -2.54,-3.81; 2 0,-3.81; 3 2.54,-3.81; 4 2.54,3.81; 5 0,3.81; 6 -2.54,3.81
HC49/S = drill 0.813: 1 -2.413,0; 2 2.413,0
DIL14S = drill 0.813: 1 -7.62,-3.81; 7 7.62,-3.81; 8 7.62,3.81; 14 -7.62,3.81
R2012 = smd 1.3 x 1.5: 1 -0.85,0; 2 0.85,0
PT-10S = drill 1.016 long: A -2.54,-1.27; E 2.54,-1.27; S 0,1.27
MA20-2W = drill 1.016 octagon: 1 -24.13,-1.27; 2 -24.13,1.27; 3 -21.59,-1.27; 4 -21.59,1.27; 5 -19.05,-1.27; 6 -19.05,1.27; 7 -16.51,-1.27; 8 -16.51,1.27; 9 -13.97,-1.27; 10 -13.97,1.27; 11 -11.43,-1.27; 12 -11.43,1.27; 13 -8.89,-1.27; 14 -8.89,1.27; 15 -6.35,-1.27; 16 -6.35,1.27; 17 -3.81,-1.27; 18 -3.81,1.27; 19 -1.27,-1.27; 20 -1.27,1.27; 21 1.27,-1.27; 22 1.27,1.27; 23 3.81,-1.27; 24 3.81,1.27; 25 6.35,-1.27; 26 6.35,1.27; 27 8.89,-1.27; 28 8.89,1.27; 29 11.43,-1.27; 30 11.43,1.27; 31 13.97,-1.27; 32 13.97,1.27; 33 16.51,-1.27; 34 16.51,1.27; 35 19.05,-1.27; 36 19.05,1.27; 37 21.59,-1.27; 38 21.59,1.27; 39 24.13,-1.27; 40 24.13,1.27
MA10-1 = drill 1.016 long: 1 -11.43,0; 2 -8.89,0; 3 -6.35,0; 4 -3.81,0; 5 -1.27,0; 6 1.27,0; 7 3.81,0; 8 6.35,0; 9 8.89,0; 10 11.43,0
MA05-2 = drill 1.016 octagon: 1 -5.08,-1.27; 2 -5.08,1.27; 3 -2.54,-1.27; 4 -2.54,1.27; 5 0,-1.27; 6 0,1.27; 7 2.54,-1.27; 8 2.54,1.27; 9 5.08,-1.27; 10 5.08,1.27

### Placement (x,y rotation side)
C101  93.34,4.45 0 top
C102  93.34,6.99 0 top
C103  79.38,15.24 180 top
C104  29.84,14.61 0 top
C105  78.74,12.06 180 top
C106  92.08,79.38 270 bottom
C107  29.84,7.62 0 top
C201  92.71,62.87 270 bottom
C202  80.01,36.2 0 top
C203  73.03,41.27 180 top
C204  44.45,26.67 180 bottom
C205  79.38,44.45 0 top
C301  26.04,33.02 180 top
C302  26.04,26.67 180 top
C303  13.97,91.44 90 top
C304  44.45,30.48 180 bottom
C305  42.55,95.25 180 top
C306  53.98,95.25 180 top
C307  15.88,97.16 180 top
C401  79.38,66.67 0 top
C402  12.06,36.2 0 top
C403  40.64,74.93 0 top
C404  80.01,71.12 0 top
C405  58.42,80.64 0 bottom
C406  46.99,80.64 180 bottom
D401  23.5,73.03 270 top
IC101  88.9,29.21 90 top
IC102  92.08,81.92 90 top
IC201  60.33,28.57 180 top
IC202  36.83,22.86 180 top
IC203  50.16,52.07 180 top
IC301  36.83,34.29 180 top
IC302  24.13,92.71 0 top
IC401  6.99,25.4 270 top
IC402  60.33,70.48 180 top
J301  4.45,88.9 0 top
J401  0,71.75 270 top
J402  0,52.07 270 top
LED401  66.04,84.45 0 top
LED402  63.5,84.45 0 top
OK401  31.75,72.39 270 top
Q401  52.7,80.64 180 top
QG201  88.9,58.42 270 top
R301  69.22,53.34 90 top
R302  71.75,53.34 90 top
R303  70.23,50.16 0 top
R304  78.74,56.52 180 top
R305  43.18,87 0 top
R306  54.61,87 0 top
R307  33.02,93.98 180 top
R308  33.02,96.52 180 top
R309  26.67,93.34 180 bottom
R310  31.11,93.34 180 bottom
R311  24.77,83.82 0 top
R401  19.68,74.3 180 bottom
R402  36.2,66.67 0 top
R403  66.04,79.38 90 top
R404  63.5,79.38 90 top
R405  7.62,36.2 0 top
R406  40.64,66.67 180 top
SV101  62.87,5.71 180 top
SV102  20.32,11.43 0 top
SV103  20.32,3.81 0 top
SV104  82.55,85.09 270 top
SV105  77.47,85.09 270 top
WEED401  16.51,14.61 0 top

### Tracks (layer width: path | path; a pad name or v marks a point on that pad's centre or on a via)
!ACCESS_TIMER_CLEAR
  Bottom 0.203: IC101.23 87.63,17.78 88.27,18.41 88.27,63.5 95.89,71.12 IC102.1
!AY_DONE
  Top 0.203: IC101.10 92.71,38.23 89.81,41.13 89.81,67.8 79.51,78.11 76.83,78.11 76.2,78.74 SV105.9 SV105.7 SV105.5 SV105.3 SV105.1
!BUS_IRQ  (via drill 0.35)
  Top 0.203: v87.63,19.05 87.63,10.79 87.22,10.39 83.59,10.39 v83.19,10.79
  Bottom 0.203: IC101.14 87,40.64 87.91,39.73 87.91,19.33 v87.63,19.05 | v83.19,10.79 83.19,5.08 82.55,4.45 SV101.6
!DONE_1  (via drill 0.35)
  Top 0.203: SV104.10 83.82,79.38 86.36,76.83 v91.44,76.83
  Bottom 0.203: SV105.10 80.01,81.28 82.55,81.28 SV104.10 | v91.44,76.83 94.61,76.83 IC102.3
!DONE_2
  Bottom 0.203: SV105.8 80.01,83.82 82.55,83.82 SV104.8 85.09,82.55 85.72,81.92 92.08,81.92 93.34,83.19 93.34,85.09 93.98,85.72 IC102.6
!DONE_3
  Bottom 0.203: SV105.6 80.01,86.36 82.55,86.36 SV104.6 87.63,85.09 IC102.11
!DONE_4
  Top 0.203: SV104.4 85.09,87.63 85.72,87 85.72,79.38 87,78.11 IC102.14
  Bottom 0.203: SV105.4 80.01,88.9 82.55,88.9 SV104.4
!MIDI_IRQ  (via drill 0.35)
  Top 0.203: R406.1 IC402.13 46.35,69.22 46.99,69.85 v75.56,69.85 | v90.81,69.85 v90.81,45.72
  Bottom 0.203: v75.56,69.85 v90.81,69.85 | IC101.9 91.44,35.56 90.81,36.2 v90.81,45.72
!MIDI_UART_CS  (via drill 0.35)
  Top 0.203: IC402.14 48.9,68.58 49.53,69.22 v76.2,69.22 | v89.53,27.94 IC101.19 | v91.44,46.35 91.16,46.63 91.16,68.94 v91.44,69.22
  Bottom 0.203: v89.53,27.94 90.17,28.57 90.17,45.09 90.22,45.14 90.22,45.96 90.62,46.35 v91.44,46.35 | v76.2,69.22 v91.44,69.22
!RD  (via drill 0.35)
  Top 0.203: IC201.6 61.59,34.92 63.5,33.02 77.11,33.02 77.23,32.9 77.24,32.9 v77.47,32.68 | v62.23,46.35 v62.23,57.15 | IC402.1 74.3,72.39 72.95,71.04 63.42,71.04 v62.87,70.48
  Bottom 0.203: v77.47,32.68 84.75,25.4 IC101.20 | IC201.6 61.59,41.91 60.33,43.18 60.33,45.72 60.96,46.35 v62.23,46.35 | v62.23,57.15 62.87,57.78 v62.87,70.48
!SLOT_ACK  (via drill 0.35)
  Top 0.203: IC101.22 88.27,20.32 89.03,19.56 89.03,10.66 88.4,10.03 61.09,10.03 v60.33,10.79
  Bottom 0.203: v60.33,10.79 60.33,5.08 59.69,4.45 SV101.24
!SLOT_AS
  Top 0.203: IC101.6 89.38,24.61 89.38,10.51 88.55,9.68 51.28,9.68 50.16,8.56 50.16,5.08 49.53,4.45 SV101.32
!SLOT_CS
  Top 0.203: SV101.5 83.19,8.26 89.53,8.26 90.81,9.53 90.81,17.14 91.44,17.78 IC101.2
!SLOT_DS  (via drill 0.35)
  Top 0.203: SV101.31 48.9,8.26 50.8,10.16 58.42,10.16 59.69,11.43 60.96,11.43 62,10.39 82.14,10.39 82.6,10.85 82.6,11.04 82.94,11.38 83.43,11.38 83.77,11.04 83.77,10.85 83.82,10.79 86.36,10.79 87,11.43 v87,15.7 | v88.27,15.88 v88.27,17.14
  Bottom 0.203: IC101.5 90.81,25.4 88.9,23.5 88.9,17.78 v88.27,17.14 | v87,15.7 88.09,15.7 v88.27,15.88
!SLOT_RESET  (via drill 0.35)
  Top 0.203: v31.11,39.37 42.55,39.37 44.45,41.27 v50.8,41.27 | v52.07,38.73 67.94,38.73 69.22,37.47 IC201.3 | IC401.9 12.7,20.32 13.41,21.03 13.41,29.63 22.84,39.06 v22.84,39.38 | v69.22,27.94 69.85,27.94 70.48,27.3 70.48,15.24 69.22,13.97 v59.05,13.97
  Bottom 0.203: v52.07,38.73 50.8,40.01 v50.8,41.27 | v22.84,39.38 31.1,39.38 | 31.1,39.38 v31.11,39.37 | IC203.23 31.11,39.4 31.1,39.38 | IC201.3 v69.22,27.94 | SV101.30 52.07,4.45 52.7,5.08 52.7,10.16 56.52,13.97 v59.05,13.97
!YM_CS  (via drill 0.35)
  Top 0.203: IC201.7 59.05,34.92 61.32,32.66 76.56,32.66 v77.47,31.75
  Bottom 0.203: v77.47,31.75 77.7,31.52 77.71,31.52 83.19,26.05 83.19,23.5 83.82,22.86 IC101.21
!YM_DONE
  Top 0.203: IC101.11 90.81,40.64 90.17,41.27 90.17,67.94 81.28,76.83 SV104.9 SV104.7 SV104.5 SV104.3 SV104.1
!YM_IRQ
  Top 0.203: IC201.2 71.75,38.1 72.39,38.73 78.11,38.73 82.55,43.18 IC101.13
+5V  (via drill 0.35)
  Top 0.203: IC203.40 74.3,41.59 C203.1 | v65.41,26.67 52.7,26.67 v52.07,27.3 | v50.8,25.4 43.18,25.4 | 43.18,25.4 41.91,26.67 IC202.1 | SV102.9 29.21,14.61 C104.1 28.89,15.56 29.84,16.51 41.91,16.51 43.18,17.78 43.18,25.4 | SV103.9 29.21,7.3 C107.1 | C307.1 19.68,97.16 IC302.8 | IC201.1 C202.1 | IC401.14 10.79,35.88 10.96,36.03 | 10.96,36.03 C402.1 | R405.2 10.79,36.2 | C404.+ 78.51,66.76 C401.1 IC402.24 | v34.92,34.92 36.2,34.92 IC301.8 | v19.05,36.2 16.51,36.2 14.61,38.1 11.43,38.1 10.79,37.47 10.79,36.2 | 10.79,36.2 10.96,36.03 | R406.2 R402.2 37.05,64.98 36.2,64.14 34.29,64.14 33.66,64.77 v33.66,69.85 | OK401.6 C403.1 39.69,75.89 40.64,76.83 v45.72,76.83 | R404.1 63.5,76.83 | R403.1 66.04,76.83
  Top 0.406: C103.1 80.33,12.15 C105.+ | IC102.16 90.17,73.03 92.71,70.48 QG201.14 | C404.+ 78.74,71.35 v78.74,73.03 78.74,73.66 75.56,76.83 66.04,76.83 63.5,76.83 v45.72,76.83 | C205.+ IC203.40
  Top 0.813: SV101.1 SV101.2 C101.1 92.39,6.43 C102.+ | C103.1 IC101.24
  Bottom 0.203: C201.1 QG201.14 | IC102.4 92.39,80.64 C106.1 91.12,80.33 90.17,79.38 90.17,73.66 89.53,73.03 IC102.16 | 74.3,26.67 v65.41,26.67 | v52.07,27.3 50.8,26.04 v50.8,25.4 | C204.1 IC202.1 IC301.8 | IC203.25 36.2,42.55 39.37,39.37 39.37,31.75 IC301.8 | C304.1 IC301.8 | R309.1 21.59,93.34 20.32,94.61 IC302.8 | v19.05,36.2 33.66,36.2 v34.92,34.92 | v33.66,69.85 33.66,73.03 OK401.6
  Bottom 0.406: QG201.14 95.25,66.04 95.25,11.43 94.61,10.79 87,10.79 | R309.1 26.04,93.13 26.04,91.44 26.67,90.81 29.84,90.81 43.81,76.83 v45.72,76.83 | IC102.16 v78.74,73.03
  Bottom 0.813: SV101.1 87,10.79 87,13.97 85.72,15.24 IC101.24 83.19,15.24 74.3,24.13 74.3,26.67 IC201.1 IC203.40 | SV103.9 SV102.9
AUDIO
  Top 0.203: C303.+ 19.05,90.17 IC302.1
  Bottom 0.203: IC302.1 24.13,85.09 R311.S
AY_BC1
  Bottom 0.203: IC203.29 46.35,46.35 46.99,46.99 75.56,46.99 81.92,40.64 81.92,33.66 82.55,33.02 IC101.17
AY_BC2
  Bottom 0.203: IC203.28 43.81,46.35 44.81,47.35 75.84,47.35 82.27,40.92 82.27,36.47 83.19,35.56 IC101.16
AY_BDIR
  Bottom 0.203: IC203.27 41.27,46.35 42.62,47.7 75.99,47.7 82.63,41.07 82.63,38.66 83.19,38.1 IC101.15
CLK_A  (via drill 0.35)
  Top 0.203: IC101.1 95.25,15.24 97.16,17.14 97.16,49.53 95.89,50.8 94.61,50.8 | 94.61,50.8 QG201.8 | 94.61,50.8 94.61,69.85 92.08,72.39 92.08,88.9 90.17,90.81 IC102.9 | IC201.24 74.3,18.41 76.2,16.51 v87,16.51 | v87,52.7 v88.9,52.7
  Bottom 0.203: IC101.1 90.81,15.24 89.53,16.51 v87,16.51 | IC203.22 28.57,46.35 35.56,53.34 86.36,53.34 v87,52.7 | v88.9,52.7 90.81,50.8 QG201.8
FM_OUT  (via drill 0.35)
  Top 0.203: IC301.1 IC301.2 | v65.41,53.98 v65.41,52.07
  Bottom 0.203: R305.E 46.99,85.72 48.9,83.82 64.14,83.82 65.41,82.55 v65.41,53.98 | IC301.1 40.01,38.73 40.01,49.53 42.55,52.07 v65.41,52.07
GND  (via drill 0.35)
  other vias: 0.64,0.64 0.64,3.81 0.64,6.99 0.64,10.16 0.64,13.34 0.64,16.51 0.64,19.68 0.64,22.86 0.64,26.04 0.64,29.21 0.64,32.38 0.64,35.56 0.64,38.73 0.64,41.91 0.64,45.09 0.64,48.26 0.64,51.44 0.64,54.61 0.64,57.78 0.64,60.96 0.64,64.14 0.64,67.31 0.64,70.48 0.64,73.66 0.64,76.83 0.64,80.01 0.64,82.55 0.64,86.36 0.64,88.9 0.64,91.44 0.64,95.89 0.64,99.06 99.06,0.64 51.44,0.64 48.26,0.64 45.09,0.64 41.91,0.64 38.73,0.64 35.56,0.64 32.38,0.64 29.21,0.64 26.04,0.64 22.86,0.64 19.68,0.64 16.51,0.64 13.34,0.64 10.16,0.64 6.99,0.64 3.81,0.64 95.89,0.64 92.71,0.64 89.53,0.64 86.36,0.64 83.19,0.64 80.01,0.64 76.83,0.64 73.66,0.64 70.48,0.64 67.31,0.64 64.14,0.64 60.96,0.64 57.78,0.64 54.61,0.64 99.06,95.89 99.06,92.71 99.06,89.53 99.06,86.36 99.06,83.19 99.06,80.01 99.06,76.83 99.06,73.66 99.06,70.48 99.06,67.31 99.06,64.14 99.06,60.96 99.06,57.78 99.06,54.61 99.06,51.44 99.06,48.26 99.06,45.09 99.06,41.91 99.06,38.73 99.06,35.56 99.06,32.38 99.06,29.21 99.06,26.04 99.06,22.86 99.06,19.68 99.06,16.51 99.06,13.34 99.06,10.16 99.06,6.99 99.06,3.81 3.81,99.06 6.99,99.06 10.16,99.06 13.34,99.06 16.51,99.06 19.68,99.06 22.86,99.06 26.04,99.06 29.21,99.06 32.38,99.06 35.56,99.06 38.73,99.06 41.91,99.06 45.09,99.06 48.26,99.06 51.44,99.06 54.61,99.06 57.78,99.06 60.96,99.06 64.14,99.06 67.31,99.06 70.48,99.06 73.66,99.06 76.83,99.06 80.01,99.06 83.19,99.06 86.36,99.06 89.53,99.06 92.71,99.06 95.89,99.06 99.06,99.06 49.53,18.41 48.9,10.16 16.51,8.26 13.97,8.26 11.43,8.26 19.05,8.26 21.59,8.26 24.13,8.26 26.67,8.26 70.48,38.1 36.2,46.99 36.2,50.8 39.37,50.8 31.11,46.99 31.11,50.16 13.34,34.29 13.34,32.38 39.37,68.58 41.27,68.58 47.62,68.58 57.78,24.77 61.59,24.77 57.78,28.57 61.59,28.57 57.78,33.66 53.98,33.66 53.98,28.57 48.9,28.57 48.9,33.66 50.8,38.73 51.44,24.13 48.9,24.13 46.35,33.66 52.07,28.57 81.92,56.52 81.92,66.67 83.19,71.12 60.96,80.64 44.45,80.64 82.55,44.45 85.09,12.7 82.55,12.7 83.82,12.7 82.55,13.97 81.92,11.43 88.27,12.06 88.27,14.61 92.08,12.06 90.81,24.13
  pour Top: 0,0 0,99.69 99.69,99.69 99.69,0 0.64,0
  pour Bottom: 0,0 0,99.69 99.69,99.69 99.69,0 0.64,0
IOA0  (via drill 0.35)
  Top 0.203: SV102.1 8.89,13.34 9.53,13.97 12.06,13.97 13.26,15.16 13.26,16.17 13.76,16.67 13.76,29.48 23.83,39.55 v23.83,44.45
  Bottom 0.203: IC203.21 v23.83,44.45
IOA1
  Top 0.203: IC203.20 26.04,55.75 24.41,54.12 24.41,42.55 24.41,42.41 24.41,39.62 14.12,29.33 14.12,16.52 13.61,16.02 13.61,13.61 SV102.2
IOA2
  Top 0.203: SV102.3 13.97,15.88 14.47,16.38 14.47,29.18 24.77,39.48 24.77,53.98 28.57,57.78 IC203.19
IOA3
  Top 0.203: SV102.4 16.51,14.74 14.83,16.42 14.83,29.04 15,29.21 15.12,29.33 27.3,41.51 27.3,54.61 31.11,58.42 IC203.18
IOA4
  Top 0.203: IC203.17 33.66,53.98 30.11,50.43 30.11,43.81 15.18,28.89 15.18,16.57 18.14,13.61 18.77,13.61 19.05,13.34 SV102.5
IOA5
  Top 0.203: IC203.16 36.2,55.88 32.53,52.22 32.53,42.55 31.9,41.91 28.71,41.91 15.54,28.74 15.54,16.71 18.28,13.97 20.95,13.97 21.59,13.34 SV102.6
IOA6
  Top 0.203: IC203.15 38.73,57.78 35.07,54.12 35.07,42.55 34.08,41.55 28.85,41.55 15.89,28.59 15.89,16.86 18.43,14.33 21.1,14.33 21.46,13.97 23.5,13.97 24.13,13.34 SV102.7
IOA7
  Top 0.203: IC203.14 37.6,56.01 37.6,42.55 36.25,41.2 29,41.2 16.25,28.45 16.25,17.01 18.58,14.68 21.25,14.68 21.61,14.33 23.64,14.33 24,13.97 26.04,13.97 26.67,13.34 SV102.8
IOB0
  Bottom 0.203: SV103.1 9.53,3.81 10.16,4.45 10.16,13.97 14.38,18.19 14.38,40.52 31.01,57.15 43.18,57.15 43.81,57.78 IC203.13
IOB1
  Bottom 0.203: SV103.2 12.06,3.81 12.7,4.45 12.7,15.24 12.7,15.37 12.7,15.88 14.74,17.91 14.74,40.38 31.16,56.79 46,56.79 46.35,57.15 IC203.12
IOB2
  Bottom 0.203: SV103.3 14.61,3.81 15.24,4.45 15.24,13.34 15.09,13.48 15.09,40.23 31.3,56.44 48.18,56.44 48.9,57.15 IC203.11
IOB3
  Bottom 0.203: SV103.4 17.14,3.81 17.78,4.45 17.78,12.7 15.45,15.03 15.45,40.08 31.45,56.08 50.37,56.08 51.44,57.15 IC203.10
IOB4
  Bottom 0.203: SV103.5 19.68,3.81 20.32,4.45 20.32,12.7 19.05,13.97 17.01,13.97 15.8,15.18 15.8,39.93 31.6,55.73 53.19,55.73 53.98,56.52 IC203.9
IOB5
  Bottom 0.203: SV103.6 22.23,3.81 22.86,4.45 22.86,13.34 22.23,13.97 19.68,13.97 19.33,14.33 17.16,14.33 16.16,15.33 16.16,39.79 31.75,55.37 55.37,55.37 56.52,56.52 IC203.8
IOB6
  Bottom 0.203: SV103.7 24.77,3.81 25.4,4.45 25.4,13.34 24.77,13.97 22.73,13.97 22.37,14.33 19.83,14.33 19.48,14.68 17.31,14.68 16.52,15.47 16.52,39.64 31.89,55.02 58.19,55.02 59.05,55.88 IC203.7
IOB7
  Bottom 0.203: SV103.8 27.3,3.81 27.94,4.45 27.94,13.34 27.3,13.97 25.27,13.97 24.91,14.33 22.88,14.33 22.52,14.68 19.98,14.68 19.62,15.04 17.45,15.04 16.87,15.62 16.87,39.49 31.99,54.61 60.33,54.61 61.59,55.88 IC203.6
MIDI_RESET  (via drill 0.35)
  Top 0.203: IC401.8 9.53,17.78 8.89,18.41 8.89,30.61 5.36,34.14 5.36,46.5 8.74,49.89 14.96,49.89 16.79,51.71 16.79,60.47 22.13,65.81 v22.13,66.13
  Bottom 0.203: IC402.11 48.9,71.75 47.62,70.48 39.37,70.48 37.47,68.58 28.57,68.58 26.04,66.04 22.23,66.04 v22.13,66.13
MIDI_RX  (via drill 0.35)
  Top 0.203: IC402.2 71.62,74.3 68.73,71.4 40.28,71.4 38.73,69.85 OK401.4 35.56,66.89 R402.1 | LED401.C 66.19,86.2 v67.31,85.09
  Bottom 0.203: v67.31,85.09 71.75,80.64 IC402.2
MIDI_RX_+  (via drill 0.35)
  Top 0.203: J401.5 15,73.27 15.88,72.39 v24.13,72.39
  Bottom 0.203: D401.A 23.5,71.75 v24.13,72.39 OK401.2
MIDI_RX_-
  Bottom 0.203: OK401.1 23.5,74.93 | 23.5,74.93 21.17,74.93 R401.2 | D401.C 23.5,74.93
MIDI_TX  (via drill 0.35)
  Top 0.203: IC402.3 69.22,72.39 68.58,71.75 39.37,71.75 39.09,71.48 32.11,71.48 26.04,65.41 22.23,65.41 17.14,60.33 17.14,51.44 15.24,49.53 8.89,49.53 5.71,46.35 5.71,34.29 9.53,30.48 IC401.13 | v64.77,85.09 63.66,86.2 LED402.C
  Bottom 0.203: v64.77,85.09 65.41,84.45 67.31,84.45 69.22,82.55 IC402.3
MIDI_TX_-
  Bottom 0.203: IC401.10 9.53,22.86 8.89,23.5 8.89,53.98 11.98,57.07 J402.5
MIDI_UART_X1
  Bottom 0.203: 57.15,80.64 C405.2 Q401.1 54.61,80.64 53.98,80.01 IC402.9
MIDI_UART_X2
  Bottom 0.203: C406.2 Q401.2 50.8,80.64 51.44,80.01 IC402.10
N$1
  Top 0.203: R305.S 43.18,94.87 C305.+
N$2
  Top 0.203: IC102.10 89.53,88.27 90.17,87.63 90.17,81.28 89.53,80.64 IC102.13
N$3
  Top 0.203: LED401.A R403.2
N$4
  Top 0.203: C303.- J301.PIN
N$5
  Top 0.203: IC102.5 94.61,83.19 93.34,81.92 93.34,76.2 93.98,75.56 IC102.2
N$6
  Bottom 0.203: IC102.7 93.34,88.27 92.08,87 92.08,84.45 90.81,83.19 IC102.12
N$7
  Top 0.203: R306.S 54.61,94.87 C306.+
N$8
  Top 0.203: LED402.A R404.2
N$10
  Top 0.203: C305.- 40.26,93.98 R307.1
N$11
  Top 0.203: R308.1 51.69,96.52 C306.-
N$12
  Top 0.203: R308.2 R307.2 25.4,93.98 22.86,91.44 IC302.2 22.86,86.36 22.23,85.72 R311.A
N$13
  Top 0.203: IC302.7 IC302.6
N$14
  Bottom 0.203: R401.1 18.84,68.36 17.14,66.67 15.08,66.67 J401.4
N$15
  Bottom 0.203: R309.2 27.94,93.34 | 27.94,93.34 R310.1 | IC302.5 27.94,93.34
N$16
  Top 0.203: IC401.12 IC401.11
N$17
  Top 0.203: J402.4 10.88,47.07 6.77,42.97 R405.1
PSG_OUT  (via drill 0.35)
  Top 0.203: R303.1 69.22,50.33 R301.1 R302.1 72.17,52.49 73.03,53.34 v73.03,56.52 R304.2
  Bottom 0.203: R306.E 71.75,85.72 73.03,84.45 v73.03,56.52
PSG_OUT_A
  Top 0.203: R301.2 69.22,55.88 66.67,58.42 IC203.4
PSG_OUT_B
  Top 0.203: R302.2 71.75,55.88 71.12,56.52 69.85,56.52 69.22,57.15 IC203.3
PSG_OUT_C
  Top 0.203: IC203.38 69.85,44.45 70.48,45.09 70.48,48.26 71.12,48.9 71.12,50.13 R303.2
SLOT_A0  (via drill 0.35)
  Top 0.203: v87,21.59 88.27,21.59 89.03,22.35 89.03,24.76 90.81,26.54 90.81,28.57 IC101.7 93.98,30.48 94.61,29.84 94.61,16.56 v94.57,16.51 | v77.47,30.94 77.24,31.17 77.23,31.17 76.89,31.51 76.89,31.52 76.66,31.75 v66.67,31.75 56.52,31.75 55.24,33.02 55.24,37.47 v54.61,38.1 | v93.34,12.06 v93.34,9.53 | v55.88,46.35 v55.88,57.15
  Bottom 0.203: IC201.4 v66.67,31.75 | v87,21.59 83.82,21.59 82.55,22.86 82.55,25.86 v77.47,30.94 | SV101.12 74.3,3.17 74.93,2.54 92.08,2.54 93.34,3.81 v93.34,9.53 | v94.57,16.51 94.57,13.29 v93.34,12.06 | v54.61,38.1 54.61,42.55 55.24,43.18 55.24,45.72 v55.88,46.35 | v55.88,57.15 55.24,57.78 55.24,71.12 56.52,72.39 IC402.8
SLOT_A1  (via drill 0.35)
  Top 0.203: v68.58,15.88 67.94,16.51 v67.94,31.11 | v67.94,46.35 v67.94,48.28 | v57.15,48.28 v57.15,57.15
  Bottom 0.203: SV101.10 76.2,4.45 75.56,5.08 75.56,7.62 68.58,14.61 v68.58,15.88 | v67.94,31.11 v67.94,46.35 | v67.94,48.28 v57.15,48.28 | v57.15,57.15 57.78,57.78 57.78,71.12 59.05,72.39 IC402.7
SLOT_A2  (via drill 0.35)
  Top 0.203: v59.69,57.15 v59.69,48.9 | v67.94,49.09 68.17,48.86 68.19,48.86 69.85,47.2 v69.85,46.35 | v73.03,27.94 73.03,11.62 v73.12,11.52
  Bottom 0.203: SV101.8 78.74,4.45 78.11,5.08 78.11,7.62 77.47,8.26 75.56,8.26 75.56,8.44 73.12,10.89 v73.12,11.52 | IC402.6 61.59,72.39 60.33,71.12 60.33,57.78 v59.69,57.15 | v59.69,48.9 59.88,49.09 v67.94,49.09 | v69.85,46.35 70.48,45.72 70.48,43.18 71.12,42.55 71.75,42.55 72.39,41.91 72.39,38.73 73.03,38.1 v73.03,27.94
SLOT_A8
  Top 0.203: IC101.3 90.45,18.06 90.45,9.8 89.26,8.61 71.48,8.61 70.48,7.62 70.48,5.08 69.85,4.45 SV101.16
SLOT_A9  (via drill 0.35)
  Top 0.203: IC101.8 95.25,33.02 95.93,32.34 v95.93,17.14
  Bottom 0.203: v95.93,17.14 95.89,17.1 95.89,5.71 92.35,2.18 70.84,2.18 70.48,2.54 70.48,6.35 69.85,6.99 SV101.15
SLOT_D0  (via drill 0.35)
  Top 0.203: SV101.35 43.81,10.01 46.99,13.18 49.62,13.18 55.24,18.81 55.24,22.86 51.44,26.67 IC201.10 51.44,40.01 52.35,40.92 65.68,40.92 66.67,41.91 IC203.37 v66.67,57.15
  Bottom 0.203: IC402.22 69.22,64.77 67.94,63.5 67.94,57.78 67.31,57.15 v66.67,57.15
SLOT_D1
  Top 0.203: SV101.37 41.27,8.52 46.65,13.89 49.32,13.89 52.7,17.28 52.7,24.77 51.08,26.39 51.08,32.74 48.9,34.92 IC201.11 48.9,38.1 52.07,41.27 63.5,41.27 64.14,41.91 IC203.36 64.14,54.61 65.41,55.88 65.41,63.5 66.67,64.77 IC402.21
SLOT_D2  (via drill 0.35)
  Top 0.203: IC201.13 46.35,22.23 46.99,22.86 49.53,22.86 50.16,22.23 v50.16,16.84 50.16,15.88 48.9,14.61 46.35,14.61 SV101.39 | IC402.20 64.14,64.77 62.87,63.5 62.87,45.09 62.23,44.45 IC203.35
  Bottom 0.203: IC203.35 61.59,43.18 62.87,41.91 62.87,19.68 60.25,17.07 50.39,17.07 v50.16,16.84
SLOT_D3  (via drill 0.35)
  Top 0.203: IC201.14 v48.9,17.14 48.9,15.24 48.62,14.96 46.21,14.96 40.14,8.89 37.47,8.89 36.83,8.26 36.83,5.71 38.1,4.45 SV101.40 | IC402.19 61.59,64.77 60.33,63.5 60.33,45.09 59.69,44.45 IC203.34
  Bottom 0.203: IC203.34 59.05,43.18 60.33,41.91 60.33,19.05 58.7,17.42 49.17,17.42 v48.9,17.14
SLOT_D4
  Top 0.203: IC201.15 51.44,16.51 49.17,14.25 46.5,14.25 40.01,7.75 40.01,5.08 40.64,4.45 SV101.38 | IC402.18 59.05,64.77 57.78,63.5 57.78,45.09 57.15,44.45 IC203.33
  Bottom 0.203: IC203.33 56.52,43.18 55.24,41.91 55.24,32.38 55.24,19.05 54.69,18.49 51.99,18.49 51.44,19.05 IC201.15
SLOT_D5
  Top 0.203: IC201.16 53.98,18.04 49.47,13.54 46.8,13.54 42.55,9.29 42.55,5.08 43.18,4.45 SV101.36 | IC402.17 56.52,64.77 55.24,63.5 55.24,45.09 54.61,44.45 IC203.32
  Bottom 0.203: IC203.32 53.98,43.18 52.7,41.91 52.7,21.59 53.34,20.95 IC201.16
SLOT_D6
  Top 0.203: IC201.17 56.52,19.58 49.76,12.83 47.14,12.83 45.09,10.78 45.09,5.08 45.72,4.45 SV101.34 | IC402.16 53.98,64.77 52.7,63.5 52.7,45.09 52.07,44.45 IC203.31
  Bottom 0.203: IC203.31 51.44,43.18 50.16,41.91 50.16,19.05 51.08,18.14 55.6,18.14 56.52,19.05 IC201.17
SLOT_D7
  Top 0.203: SV101.33 46.35,11.54 47.28,12.47 49.91,12.47 56.49,19.05 58.42,19.05 59.05,19.68 IC201.18 | IC402.15 51.44,64.77 50.16,63.5 50.16,45.09 49.53,44.45 IC203.30
  Bottom 0.203: IC203.30 48.9,43.18 47.62,41.91 47.62,18.41 48.26,17.78 58.42,17.78 59.05,18.41 IC201.18
SLOT_R/!W!  (via drill 0.35)
  Top 0.203: IC101.4 90.09,20.24 90.09,10.08 88.98,8.97 60.4,8.97 59.05,7.62 SV101.23 | v65.41,22.86 v65.41,17.78 | v65.41,46.35 65.41,50.8 66.04,51.44 v66.04,56.52
  Bottom 0.203: v65.41,22.86 64.14,24.13 IC201.5 64.14,41.91 65.41,43.18 v65.41,46.35 | v65.41,17.78 57.78,10.16 57.78,6.35 58.42,6.99 SV101.23 | IC402.23 71.75,64.77 70.48,63.5 70.48,57.15 69.85,56.52 v66.04,56.52
YM_DAC_CLK
  Bottom 0.203: IC201.23 71.75,19.68 70.48,18.41 64.64,18.41 61.39,15.16 47.33,15.16 43.74,18.75 43.74,21.03 43.18,21.59 34.29,21.59 33.02,20.32 IC202.5
YM_DAC_DATA
  Bottom 0.203: IC201.21 61.24,15.52 47.48,15.52 44.09,18.9 44.09,21.31 41.91,23.5 34.92,23.5 33.02,25.4 IC202.4
YM_DAC_SY
  Bottom 0.203: IC201.20 64.14,19.05 60.96,15.88 47.62,15.88 44.45,19.05 44.45,21.46 42.06,23.85 36.47,23.85 35.56,24.77 IC202.3
YM_OUT_BUF
  Bottom 0.203: IC301.3 36.83,36.83 36.83,27.94 IC202.2
YM_OUT_MP
  Top 0.203: IC202.8 40.01,19.05 39.37,19.68 39.37,29.21 IC301.7 IC301.6 35.56,32.38 34.92,33.02 C301.+
YM_OUT_RB
  Top 0.203: IC202.7 37.47,19.05 36.83,19.68 36.83,20.95 34.29,23.5 34.29,29.21 IC301.5 31.11,30.48 27.3,26.67 C302.+

### Text on the board
tNames: 68komputer Sound Board | Rev 01 - By Tristan Seifert | Wait States | 0 4 3 2 1 | MIDI In | AY | YM | MIDI Out | IO A | IO B